# EAGLE design Daughter Card (EAGLE 6.5.1)
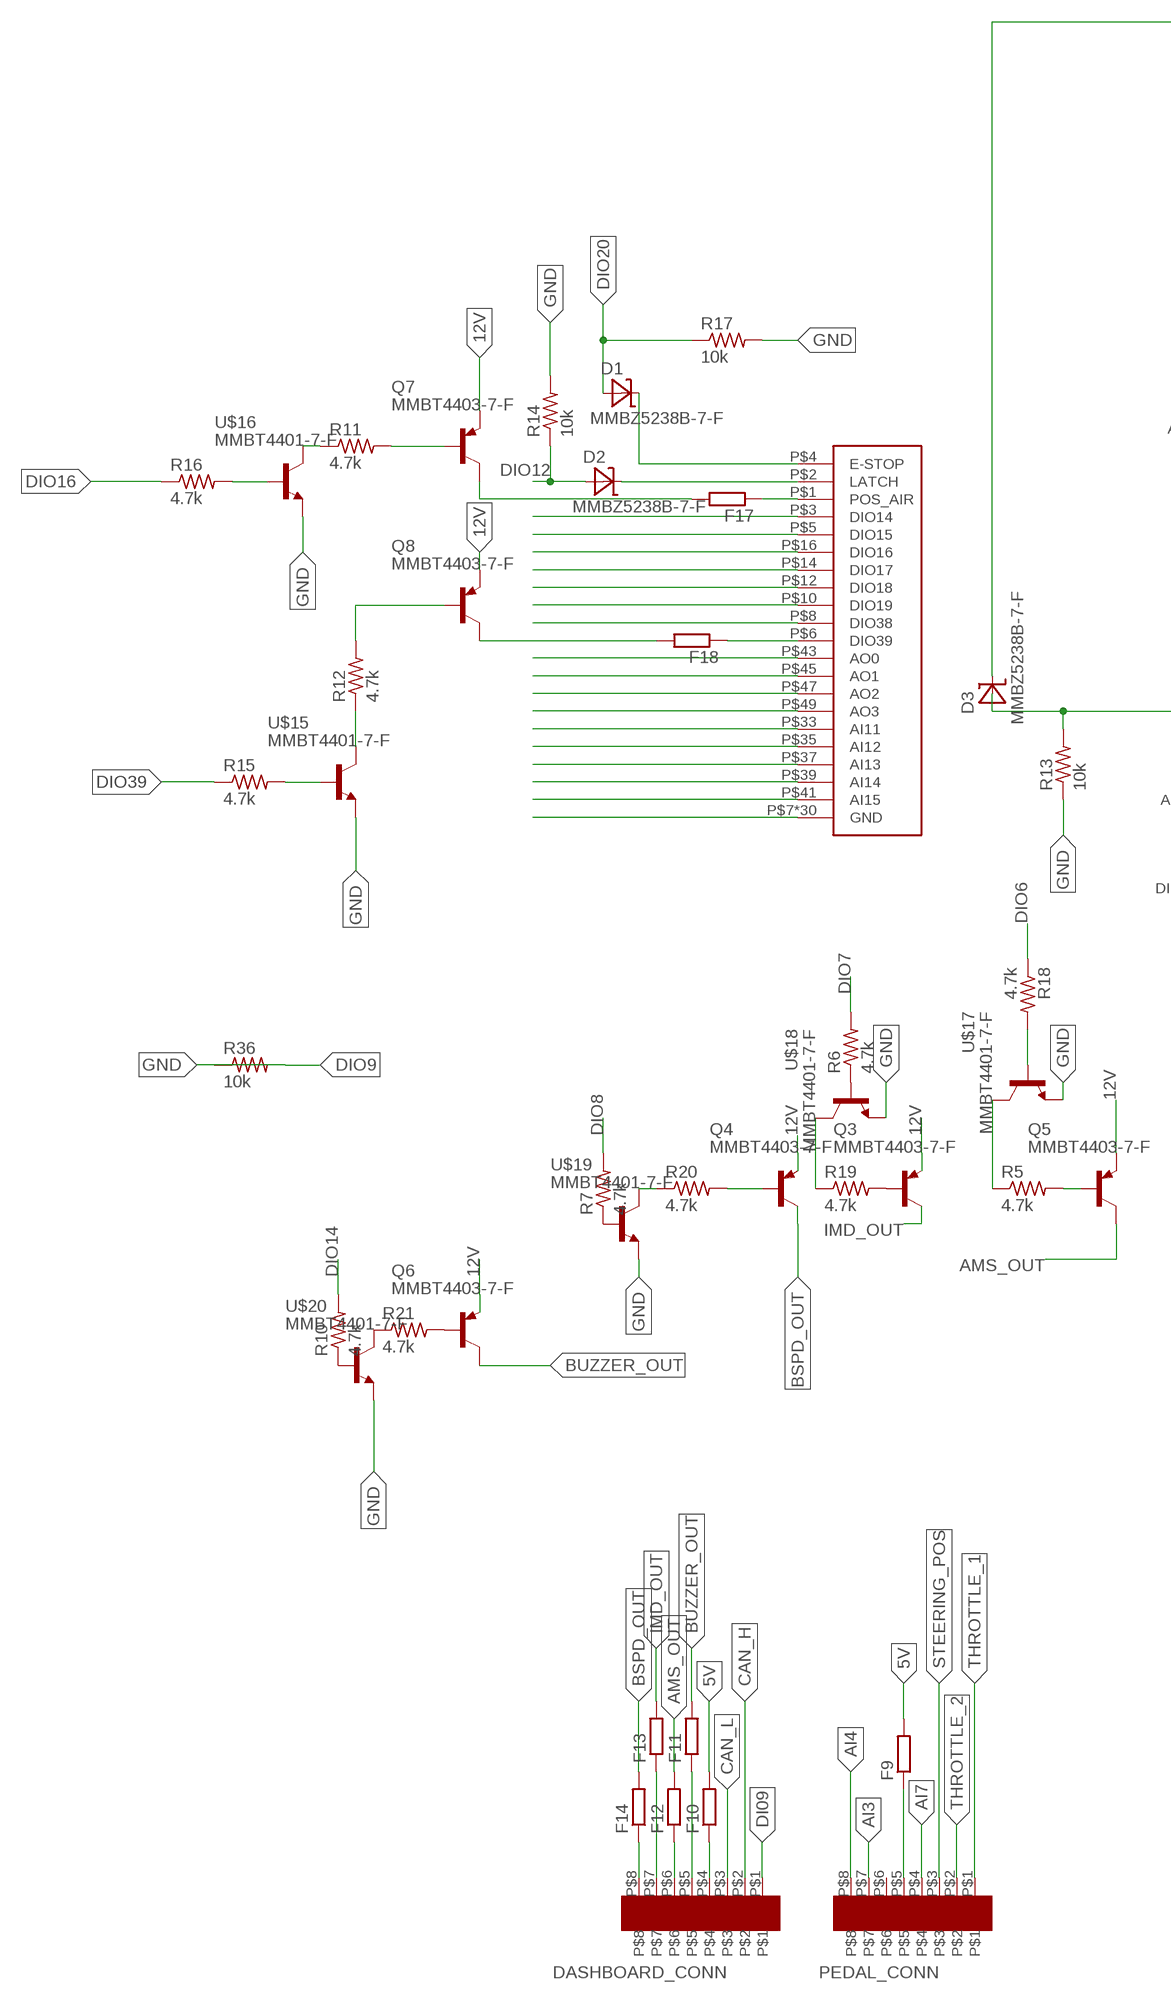
[diagram p0: schematic, sheet 1, part 1 of 2]
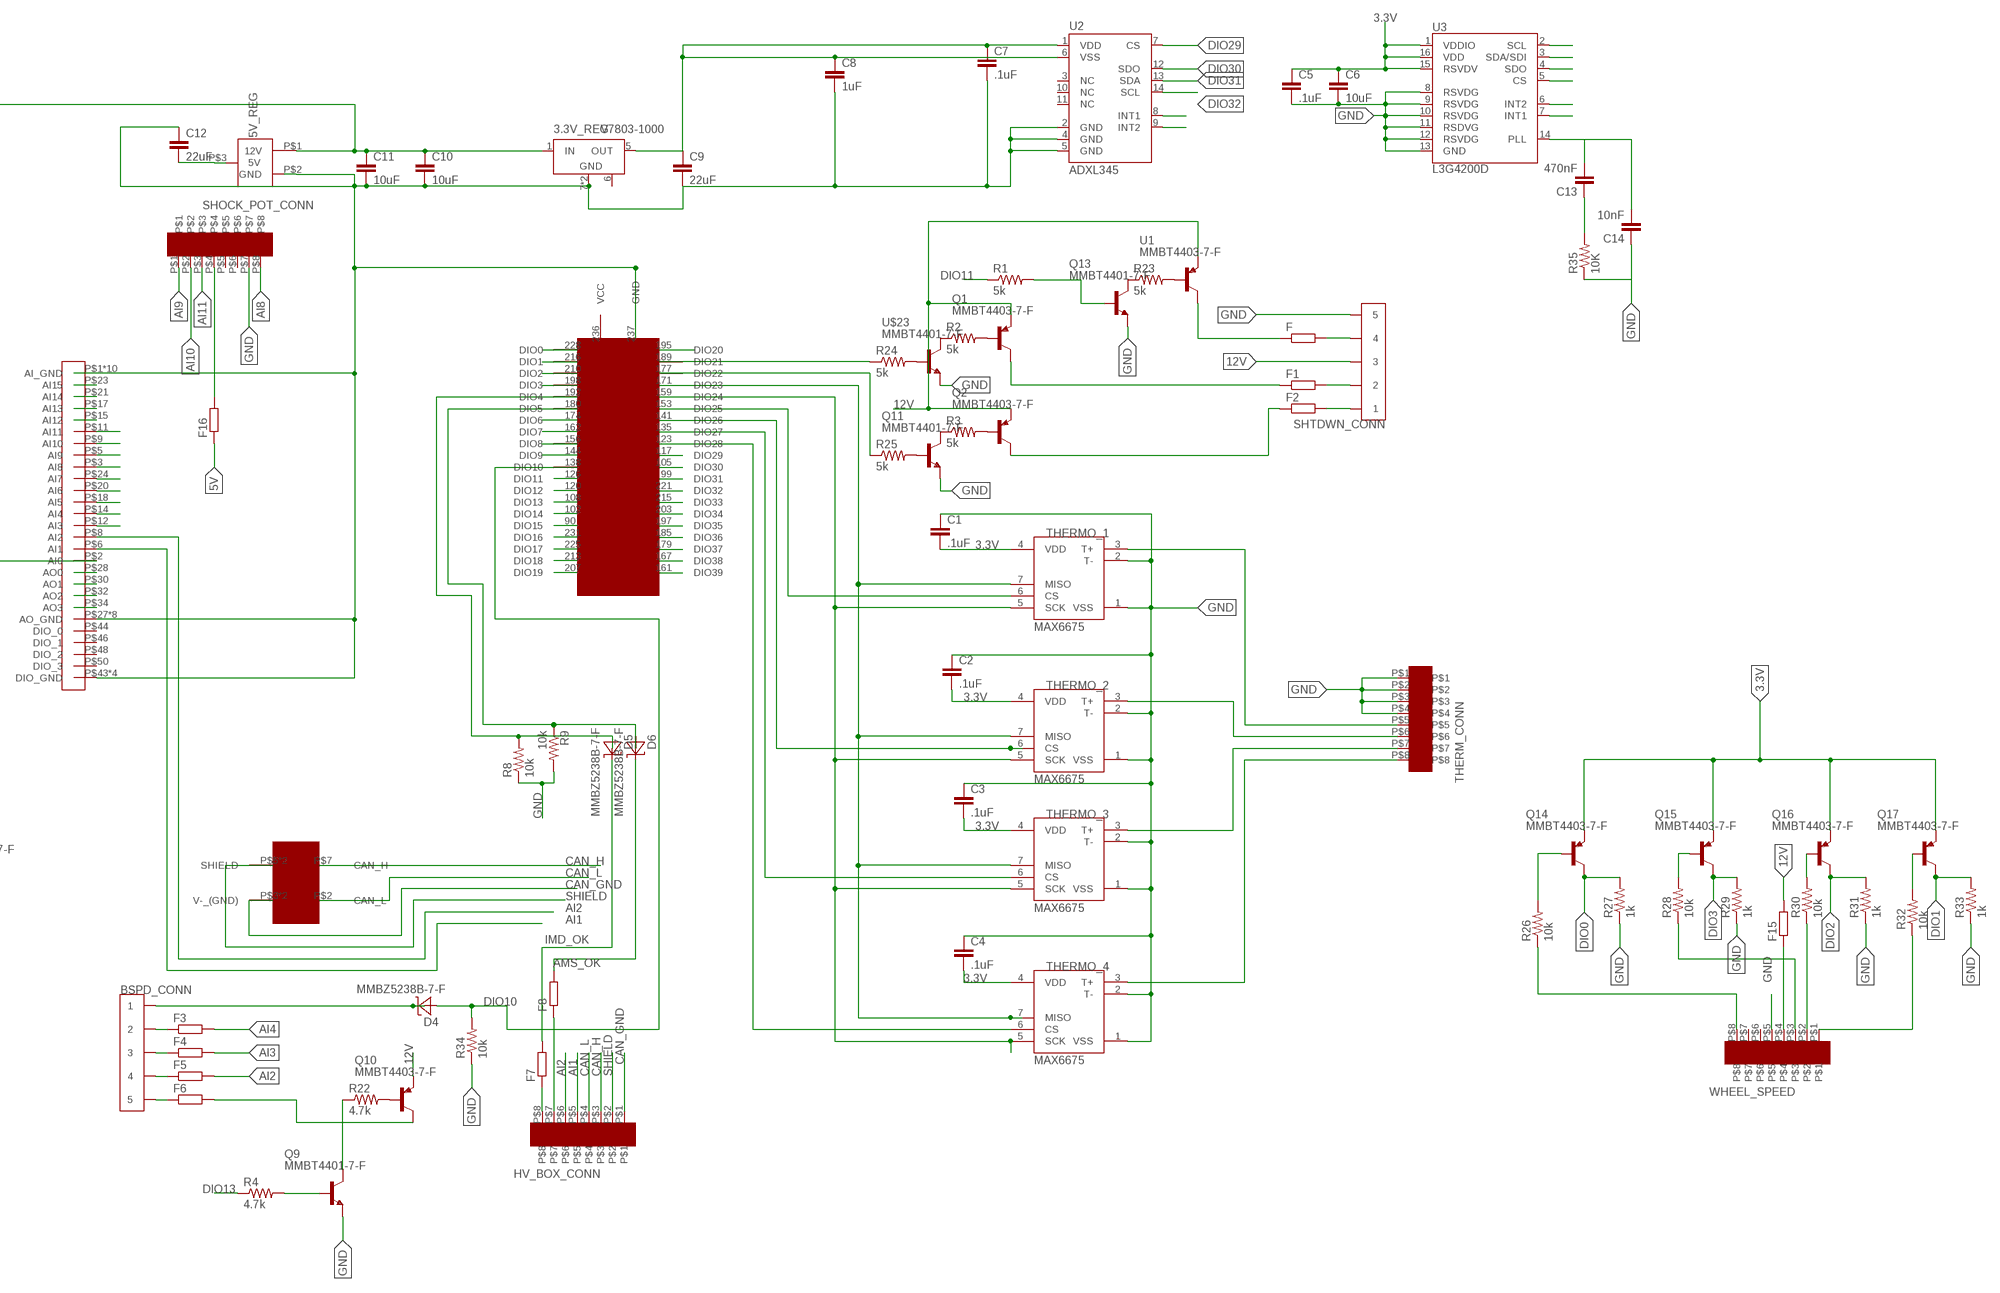
[diagram p1: schematic, sheet 1, part 2 of 2]

## Parts
3.3V_REG  V7803-1000  [V78XX-1000]
5V_REG  V78XX-1500  [V78XX-1500R]
BSPD_CONN  CONN_5  [CONNECTOR_5]
C1  .1uF  CAP0603-CAP  [0603-CAP]
C2  .1uF  CAP0603-CAP  [0603-CAP]
C3  .1uF  CAP0603-CAP  [0603-CAP]
C4  .1uF  CAP0603-CAP  [0603-CAP]
C5  .1uF  CAP0603-CAP  [0603-CAP]
C6  10uF  CAP0603-CAP  [0603-CAP]
C7  .1uF  CAP0603-CAP  [0603-CAP]
C8  1uF  CAP0603-CAP  [0603-CAP]
C9  22uF  CAP0603-CAP  [0603-CAP]
C10  10uF  CAP0603-CAP  [0603-CAP]
C11  10uF  CAP0603-CAP  [0603-CAP]
C12  22uF  CAP0603-CAP  [0603-CAP]
C13  470nF  CAP0603-CAP  [0603-CAP]
C14  10nF  CAP0603-CAP  [0603-CAP]
D1  MMBZ5238B-7-F  [SOT-23-3]
D2  MMBZ5238B-7-F  [SOT-23-3]
D3  MMBZ5238B-7-F  [SOT-23-3]
D4  MMBZ5238B-7-F  [SOT-23-3]
D5  MMBZ5238B-7-F  [SOT-23-3]
D6  MMBZ5238B-7-F  [SOT-23-3]
DASHBOARD_CONN  EN3_PCB_8  [EN3_PCB_8]
F  R-EU_R0402  [R0402]
F1  R-EU_R0402  [R0402]
F2  R-EU_R0402  [R0402]
F3  R-EU_R0402  [R0402]
F4  R-EU_R0402  [R0402]
F5  R-EU_R0402  [R0402]
F6  R-EU_R0402  [R0402]
F7  R-EU_R0402  [R0402]
F8  R-EU_R0402  [R0402]
F9  R-EU_R0402  [R0402]
F10  R-EU_R0402  [R0402]
F11  R-EU_R0402  [R0402]
F12  R-EU_R0402  [R0402]
F13  R-EU_R0402  [R0402]
F14  R-EU_R0402  [R0402]
F15  R-EU_R0402  [R0402]
F16  R-EU_R0402  [R0402]
F17  R-EU_R0402  [R0402]
F18  R-EU_R0402  [R0402]
HV_BOX_CONN  EN3_PCB_8  [EN3_PCB_8]
PEDAL_CONN  EN3_PCB_8  [EN3_PCB_8]
Q1  MMBT4403-7-F  [SOT-23-3]
Q2  MMBT4403-7-F  [SOT-23-3]
Q3  MMBT4403-7-F  [SOT-23-3]
Q4  MMBT4403-7-F  [SOT-23-3]
Q5  MMBT4403-7-F  [SOT-23-3]
Q6  MMBT4403-7-F  [SOT-23-3]
Q7  MMBT4403-7-F  [SOT-23-3]
Q8  MMBT4403-7-F  [SOT-23-3]
Q9  MMBT4401-7-F  [SOT-23-3]
Q10  MMBT4403-7-F  [SOT-23-3]
Q11  MMBT4401-7-F  [SOT-23-3]
Q13  MMBT4401-7-F  [SOT-23-3]
Q14  MMBT4403-7-F  [SOT-23-3]
Q15  MMBT4403-7-F  [SOT-23-3]
Q16  MMBT4403-7-F  [SOT-23-3]
Q17  MMBT4403-7-F  [SOT-23-3]
R1  5k  R-US_R0402  [R0402]
R2  5k  R-US_R0402  [R0402]
R3  5k  R-US_R0402  [R0402]
R4  4.7k  R-US_R0402  [R0402]
R5  4.7k  R-US_R0402  [R0402]
R6  4.7k  R-US_R0402  [R0402]
R7  4.7k  R-US_R0402  [R0402]
R8  10k  R-US_R0402  [R0402]
R9  10k  R-US_R0402  [R0402]
R10  4.7k  R-US_R0402  [R0402]
R11  4.7k  R-US_R0402  [R0402]
R12  4.7k  R-US_R0402  [R0402]
R13  10k  R-US_R0402  [R0402]
R14  10k  R-US_R0402  [R0402]
R15  4.7k  R-US_R0402  [R0402]
R16  4.7k  R-US_R0402  [R0402]
R17  10k  R-US_R0402  [R0402]
R18  4.7k  R-US_R0402  [R0402]
R19  4.7k  R-US_R0402  [R0402]
R20  4.7k  R-US_R0402  [R0402]
R21  4.7k  R-US_R0402  [R0402]
R22  4.7k  R-US_R0402  [R0402]
R23  5k  R-US_R0402  [R0402]
R24  5k  R-US_R0402  [R0402]
R25  5k  R-US_R0402  [R0402]
R26  10k  R-US_R0402  [R0402]
R27  1k  R-US_R0402  [R0402]
R28  10k  R-US_R0402  [R0402]
R29  1k  R-US_R0402  [R0402]
R30  10k  R-US_R0402  [R0402]
R31  1k  R-US_R0402  [R0402]
R32  10k  R-US_R0402  [R0402]
R33  1k  R-US_R0402  [R0402]
R34  10k  R-US_R0402  [R0402]
R35  10K  RESISTOR0603-RES  [0603-RES]
R36  10k  R-US_R0402  [R0402]
SBRIO_ANALOG  SBRIO_MIO  [SBRIO_J502_J503]
SBRIO_AUX  SBRIO_AUX  [SBRIO_J502_J503]
SHOCK_POT_CONN  EN3_PCB_8  [EN3_PCB_8]
SHTDWN_CONN  CONN_5  [CONNECTOR_5]
THERM_CONN  EN3_PCB_8  [EN3_PCB_8]
THERMO_1  MAX6675  [SO08]
THERMO_2  MAX6675  [SO08]
THERMO_3  MAX6675  [SO08]
THERMO_4  MAX6675  [SO08]
U1  MMBT4403-7-F  [SOT-23-3]
U2  ADXL345  [LGA14]
U3  L3G4200D  [LGA16-4X4]
U$2  SBRIO_W500  [SBRIO_W]
U$3  SBRIO_RMC  [SEAM-40-XX.X-XX-06-X-A]
U$15  MMBT4401-7-F  [SOT-23-3]
U$16  MMBT4401-7-F  [SOT-23-3]
U$17  MMBT4401-7-F  [SOT-23-3]
U$18  MMBT4401-7-F  [SOT-23-3]
U$19  MMBT4401-7-F  [SOT-23-3]
U$20  MMBT4401-7-F  [SOT-23-3]
U$23  MMBT4401-7-F  [SOT-23-3]
WHEEL_SPEED  EN3_PCB_8  [EN3_PCB_8]

## Nets
3.3V: 3.3V_REG.5(OUT) C1.2 C2.2 C3.2 C4.2 C5.1 C6.1 C7.1 C8.1 C9.1 Q14.P$3(E) Q15.P$3(E) Q16.P$3(E) Q17.P$3(E) THERMO_1.4(VDD) THERMO_2.4(VDD) THERMO_3.4(VDD) THERMO_4.4(VDD) U2.1(VDD) U2.6(VSS) U3.1(VDDIO) U3.15(RSVDV) U3.16(VDD)
5V: 5V_REG.P$3(5V) C12.2 F9.2 F10.2 F16.1
12V: 3.3V_REG.1(IN) 5V_REG.P$1(12V) C10.1 C11.1 D3.P$1(C) F15.2 Q1.P$3(E) Q2.P$3(E) Q3.P$3(E) Q4.P$3(E) Q5.P$3(E) Q6.P$3(E) Q7.P$3(E) Q8.P$3(E) Q10.P$3(E) SHTDWN_CONN.5 SHTDWN_CONN.6 U1.P$3(E)
AI1: HV_BOX_CONN.P$5 SBRIO_ANALOG.P$6(AI1)
AI2: F5.2 HV_BOX_CONN.P$6 SBRIO_ANALOG.P$8(AI2)
AI3: F4.2 PEDAL_CONN.P$7 SBRIO_ANALOG.P$12(AI3)
AI4: F3.2 PEDAL_CONN.P$8 SBRIO_ANALOG.P$14(AI4)
AI7: PEDAL_CONN.P$4 SBRIO_ANALOG.P$24(AI7)
AI8: SBRIO_ANALOG.P$3(AI8) SHOCK_POT_CONN.P$8
AI9: SBRIO_ANALOG.P$5(AI9) SHOCK_POT_CONN.P$1
AI10: SBRIO_ANALOG.P$9(AI10) SHOCK_POT_CONN.P$2
AI11: SBRIO_ANALOG.P$11(AI11) SBRIO_AUX.P$33(AI11) SHOCK_POT_CONN.P$3
AI12: SBRIO_ANALOG.P$15(AI12) SBRIO_AUX.P$35(AI12)
AI13: SBRIO_ANALOG.P$17(AI13) SBRIO_AUX.P$37(AI13)
AI15: SBRIO_ANALOG.P$23(AI15) SBRIO_AUX.P$41(AI15)
AMS_OK: D6.P$1(C) F8.2
AMS_OUT: F12.2 Q5.P$1(C)
AO0: SBRIO_ANALOG.P$28(AO0) SBRIO_AUX.P$43(AO0)
AO1: SBRIO_ANALOG.P$30(AO1) SBRIO_AUX.P$45(AO1)
AO2: SBRIO_ANALOG.P$32(AO2) SBRIO_AUX.P$47(AO2)
AO3: SBRIO_ANALOG.P$34(AO3) SBRIO_AUX.P$49(AO3)
BSPD_OUT: F14.2 Q4.P$1(C)
BUZZER_OUT: F11.2 Q6.P$1(C)
CAN_GND: HV_BOX_CONN.P$1 U$2.P$3(V-_(GND)) U$2.P$6(V-_(GND))
CAN_H: DASHBOARD_CONN.P$2 HV_BOX_CONN.P$3 U$2.P$7(CAN_H)
CAN_L: DASHBOARD_CONN.P$3 HV_BOX_CONN.P$4 U$2.P$2(CAN_L)
DI09: DASHBOARD_CONN.P$1
DIO0: Q14.P$1(C) R27.2 U$3.228(DIO0)
DIO1: Q17.P$1(C) R33.2 U$3.216(DIO1)
DIO2: Q16.P$1(C) R31.2 U$3.210(DIO2)
DIO3: Q15.P$1(C) R29.2 U$3.198(DIO3)
DIO6: R18.1 U$3.174(DIO6)
DIO7: R6.2 U$3.162(DIO7)
DIO8: R7.2 U$3.156(DIO8)
DIO9: R36.2 U$3.144(DIO9)
DIO10: D4.P$2(A) R34.2 U$3.138(DIO10)
DIO11: R1.1 U$3.126(DIO11)
DIO12: D2.P$2(A) R14.1 U$3.120(DIO12)
DIO13: R4.1 U$3.108(DIO13)
DIO14: R10.2 SBRIO_AUX.P$3(DIO14) U$3.102(DIO14)
DIO15: SBRIO_AUX.P$5(DIO15) U$3.90(DIO15)
DIO16: R16.1 SBRIO_AUX.P$16(DIO16) U$3.231(DIO16)
DIO17: SBRIO_AUX.P$14(DIO17) U$3.225(DIO17)
DIO18: SBRIO_AUX.P$12(DIO18) U$3.213(DIO18)
DIO19: SBRIO_AUX.P$10(DIO19) U$3.207(DIO19)
DIO20: D1.P$2(A) R17.1 U$3.195(DIO20)
DIO29: U2.7(CS) U$3.117(DIO29)
DIO30: U2.12(SDO) U3.4(SDO) U$3.105(DIO30)
DIO31: U2.13(SDA) U3.3(SDA/SDI) U$3.99(DIO31)
DIO32: U2.14(SCL) U3.2(SCL) U$3.221(DIO32)
DIO33: U3.5(CS) U$3.215(DIO33)
DIO34: U3.7(INT1) U$3.203(DIO34)
DIO35: U3.6(INT2) U$3.197(DIO35)
DIO36: U2.8(INT1) U$3.185(DIO36)
DIO37: U2.9(INT2) U$3.179(DIO37)
DIO38: SBRIO_AUX.P$8(DIO38) U$3.167(DIO38)
DIO39: R15.1 U$3.161(DIO39)
GND: 3.3V_REG.7(GND) 3.3V_REG.9(GND) 5V_REG.P$2(GND) C1.1 C2.1 C3.1 C4.1 C5.2 C6.2 C7.2 C8.2 C9.2 C10.2 C11.2 C12.1 C14.1 Q9.P$3(E) Q11.P$3(E) Q13.P$3(E) R8.1 R9.2 R13.1 R14.2 R17.2 R27.1 R29.1 R31.1 R33.1 R34.1 R35.1 R36.1 SBRIO_ANALOG.P$1(AI_GND) SBRIO_ANALOG.P$4(AI_GND) SBRIO_ANALOG.P$7(AI_GND) SBRIO_ANALOG.P$10(AI_GND) SBRIO_ANALOG.P$13(AI_GND) SBRIO_ANALOG.P$16(AI_GND) SBRIO_ANALOG.P$19(AI_GND) SBRIO_ANALOG.P$22(AI_GND) SBRIO_ANALOG.P$25(AI_GND) SBRIO_ANALOG.P$26(AI_GND) SBRIO_ANALOG.P$27(AO_GND) SBRIO_ANALOG.P$29(AO_GND) SBRIO_ANALOG.P$31(AO_GND) SBRIO_ANALOG.P$33(AO_GND) SBRIO_ANALOG.P$35(AO_GND) SBRIO_ANALOG.P$37(AO_GND) SBRIO_ANALOG.P$39(AO_GND) SBRIO_ANALOG.P$41(AO_GND) SBRIO_ANALOG.P$43(DIO_GND) SBRIO_ANALOG.P$45(DIO_GND) SBRIO_ANALOG.P$47(DIO_GND) SBRIO_ANALOG.P$49(DIO_GND) SBRIO_AUX.P$7(GND) SBRIO_AUX.P$9(GND) SBRIO_AUX.P$11(GND) SBRIO_AUX.P$13(GND) SBRIO_AUX.P$15(GND) SBRIO_AUX.P$17(GND) SBRIO_AUX.P$18(GND) SBRIO_AUX.P$19(GND) SBRIO_AUX.P$20(GND) SBRIO_AUX.P$21(GND) SBRIO_AUX.P$22(GND) SBRIO_AUX.P$23(GND) SBRIO_AUX.P$24(GND) SBRIO_AUX.P$25(GND) SBRIO_AUX.P$26(GND) SBRIO_AUX.P$27(GND) SBRIO_AUX.P$28(GND) SBRIO_AUX.P$29(GND) SBRIO_AUX.P$30(GND) SBRIO_AUX.P$31(GND) SBRIO_AUX.P$32(GND) SBRIO_AUX.P$34(GND) SBRIO_AUX.P$36(GND) SBRIO_AUX.P$38(GND) SBRIO_AUX.P$40(GND) SBRIO_AUX.P$42(GND) SBRIO_AUX.P$44(GND) SBRIO_AUX.P$46(GND) SBRIO_AUX.P$48(GND) SBRIO_AUX.P$50(GND) SHOCK_POT_CONN.P$7 SHTDWN_CONN.9 SHTDWN_CONN.10 THERM_CONN.P$1 THERM_CONN.P$2 THERM_CONN.P$3 THERM_CONN.P$4 THERMO_1.1(VSS) THERMO_1.2(T-) THERMO_2.1(VSS) THERMO_2.2(T-) THERMO_3.1(VSS) THERMO_3.2(T-) THERMO_4.1(VSS) THERMO_4.2(T-) U2.2(GND) U2.4(GND) U2.5(GND) U3.8(RSVDG) U3.9(RSVDG) U3.10(RSVDG) U3.11(RSDVG) U3.12(RSVDG) U3.13(GND) U$3.237(GND) U$15.P$3(E) U$16.P$3(E) U$17.P$3(E) U$18.P$3(E) U$19.P$3(E) U$20.P$3(E) U$23.P$3(E) WHEEL_SPEED.P$5
IMD_OK: D5.P$1(C) F7.2
IMD_OUT: F13.2 Q3.P$1(C)
N$1: D2.P$1(C) SBRIO_AUX.P$2(LATCH)
N$2: D1.P$1(C) SBRIO_AUX.P$4(E-STOP)
N$3: R32.1 WHEEL_SPEED.P$1
N$4: D3.P$2(A) R13.2 SBRIO_ANALOG.P$2(AI0)
N$5: Q6.P$2(B) R21.2
N$6: Q16.P$2(B) R30.2
N$7: F1.1 Q1.P$1(C)
N$8: F2.1 Q2.P$1(C)
N$9: R28.1 WHEEL_SPEED.P$3
N$10: R26.1 WHEEL_SPEED.P$8
N$11: R24.1 U$3.189(DIO21)
N$12: R25.1 U$3.177(DIO22)
N$13: F8.1 HV_BOX_CONN.P$7
N$14: F7.1 HV_BOX_CONN.P$8
N$15: D5.P$2(A) R8.2 U$3.192(DIO4)
N$16: D6.P$2(A) R9.1 U$3.180(DIO5)
N$17: THERMO_1.7(MISO) THERMO_2.7(MISO) THERMO_3.7(MISO) THERMO_4.7(MISO) U$3.171(DIO23)
N$18: THERMO_1.5(SCK) THERMO_2.5(SCK) THERMO_3.5(SCK) THERMO_4.5(SCK) U$3.159(DIO24)
N$20: F16.2 SHOCK_POT_CONN.P$4
N$21: F15.1 WHEEL_SPEED.P$4
N$22: F9.1 PEDAL_CONN.P$5
N$23: DASHBOARD_CONN.P$4 F10.1
N$24: DASHBOARD_CONN.P$5 F11.1
N$25: THERMO_1.6(CS) U$3.153(DIO25)
N$26: THERMO_2.6(CS) U$3.141(DIO26)
N$27: THERMO_3.6(CS) U$3.135(DIO27)
N$28: THERMO_4.6(CS) U$3.123(DIO28)
N$29: THERM_CONN.P$5 THERMO_1.3(T+)
N$30: THERM_CONN.P$6 THERMO_2.3(T+)
N$31: THERM_CONN.P$7 THERMO_3.3(T+)
N$32: THERM_CONN.P$8 THERMO_4.3(T+)
N$33: DASHBOARD_CONN.P$6 F12.1
N$34: DASHBOARD_CONN.P$7 F13.1
N$35: DASHBOARD_CONN.P$8 F14.1
N$36: F.2 SHTDWN_CONN.7 SHTDWN_CONN.8
N$37: C13.2 C14.2 U3.14(PLL)
N$38: C13.1 R35.2
N$39: F1.2 SHTDWN_CONN.3 SHTDWN_CONN.4
N$40: F2.2 SHTDWN_CONN.1 SHTDWN_CONN.2
N$41: BSPD_CONN.9 BSPD_CONN.10 F6.1
N$42: BSPD_CONN.1 BSPD_CONN.2 D4.P$1(C)
N$43: BSPD_CONN.7 BSPD_CONN.8 F5.1
N$44: F.1 U1.P$1(C)
N$45: F6.2 Q10.P$1(C)
N$46: R23.2 U1.P$2(B)
N$47: Q1.P$2(B) R2.2
N$48: Q2.P$2(B) R3.2
N$49: Q10.P$2(B) R22.2
N$50: Q5.P$2(B) R5.2
N$51: Q3.P$2(B) R19.2
N$52: BSPD_CONN.5 BSPD_CONN.6 F4.1
N$53: BSPD_CONN.3 BSPD_CONN.4 F3.1
N$54: Q7.P$2(B) R11.2
N$55: F17.1 SBRIO_AUX.P$1(POS_AIR)
N$56: F17.2 Q7.P$1(C)
N$57: F18.2 Q8.P$1(C)
N$58: Q8.P$2(B) R12.2
N$59: F18.1 SBRIO_AUX.P$6(DIO39)
N$60: R15.2 U$15.P$2(B)
N$61: R12.1 U$15.P$1(C)
N$62: R16.2 U$16.P$2(B)
N$63: R11.1 U$16.P$1(C)
N$64: R5.1 U$17.P$1(C)
N$65: R18.2 U$17.P$2(B)
N$66: R19.1 U$18.P$1(C)
N$67: R6.1 U$18.P$2(B)
N$68: Q4.P$2(B) R20.2
N$69: R20.1 U$19.P$1(C)
N$70: R7.1 U$19.P$2(B)
N$71: R21.1 U$20.P$1(C)
N$72: R10.1 U$20.P$2(B)
N$73: Q9.P$1(C) R22.1
N$74: Q9.P$2(B) R4.2
N$75: Q13.P$1(C) R23.1
N$76: Q13.P$2(B) R1.2
N$77: R2.1 U$23.P$1(C)
N$78: Q11.P$1(C) R3.1
N$79: R24.2 U$23.P$2(B)
N$80: Q11.P$2(B) R25.2
N$81: Q14.P$2(B) R26.2
N$82: Q15.P$2(B) R28.2
N$83: R30.1 WHEEL_SPEED.P$2
N$84: Q17.P$2(B) R32.2
SHIELD: HV_BOX_CONN.P$2 U$2.P$5(SHIELD) U$2.P$10(SHIELD)
STEERING_POS: PEDAL_CONN.P$3 SBRIO_ANALOG.P$21(AI14) SBRIO_AUX.P$39(AI14)
THROTTLE_1: PEDAL_CONN.P$1 SBRIO_ANALOG.P$18(AI5)
THROTTLE_2: PEDAL_CONN.P$2 SBRIO_ANALOG.P$20(AI6)
Unconnected: 3.3V_REG.6 PEDAL_CONN.P$6 SBRIO_ANALOG.P$44(DIO_0) SBRIO_ANALOG.P$46(DIO_1) SBRIO_ANALOG.P$48(DIO_2) SBRIO_ANALOG.P$50(DIO_3) SHOCK_POT_CONN.P$5 SHOCK_POT_CONN.P$6 U2.3(NC) U2.10(NC) U2.11(NC) WHEEL_SPEED.P$6 WHEEL_SPEED.P$7

## Power pins joined to a net without a drawn wire
VCC: U$3.236(VCC)

## Library data of the parts
3.3V_REG = formula electric:V7803-1000
5V_REG = formula electric:V78XX-1500
BSPD_CONN SHTDWN_CONN = formula electric:CONN_5
C1-C14 = SparkFun-Passives:CAP: Capacitor Standard 0603 ceramic capacitor, and 0.1" leaded capacitor.
D1-D6 = formula electric:MMBZ5238B-7-F: Digikey: MMBZ5238B-FDICT-ND
DASHBOARD_CONN HV_BOX_CONN PEDAL_CONN SHOCK_POT_CONN THERM_CONN WHEEL_SPEED = formula electric:EN3_PCB_8
F F1-F18 = resistor:R-EU_: RESISTOR, European symbol
Q1-Q8 Q10 Q14-Q17 U1 = formula electric:MMBT4403-7-F
Q9 Q11 Q13 U$15-U$20 U$23 = formula electric:MMBT4401-7-F
R1-R34 R36 = resistor:R-US_: RESISTOR, American symbol
R35 = SparkFun-Passives:RESISTOR: Resistor Basic schematic elements and footprints for 0603, 1206, and PTH resistors.
SBRIO_ANALOG = formula electric:SBRIO_MIO
SBRIO_AUX = formula electric:SBRIO_AUX: An output for a lot of the extra pins on the sbRIO.
THERMO_1-THERMO_4 = max6675:MAX6675
U2 = SparkFun-Sensors:ADXL345: 3-axis SPI/I2C 2/4/8/16g accelerometer
U3 = SparkFun-Sensors:L3G4200D: L3G4200D Three-axis, digital output gyroscope The L3G4200D is a low-power three-axis angular rate sensor, has a full scale of ±250/±500/±2000 dps and is capable of measuring rates with a user-selectable bandwidth. It includes a sensing element and an IC interface capable of providing the measured angular rate to the external world through a digital interface (I2C/SPI). Package: 4x4x1.1 LGA-16 (LGA16-4x4.PAC)
U$2 = formula electric:SBRIO_W500
U$3 = SEAM-40-XX.X-XX-06-X-A:SBRIO_RMC

## Net classes
0 default: clearance 0.205 mm

## Board
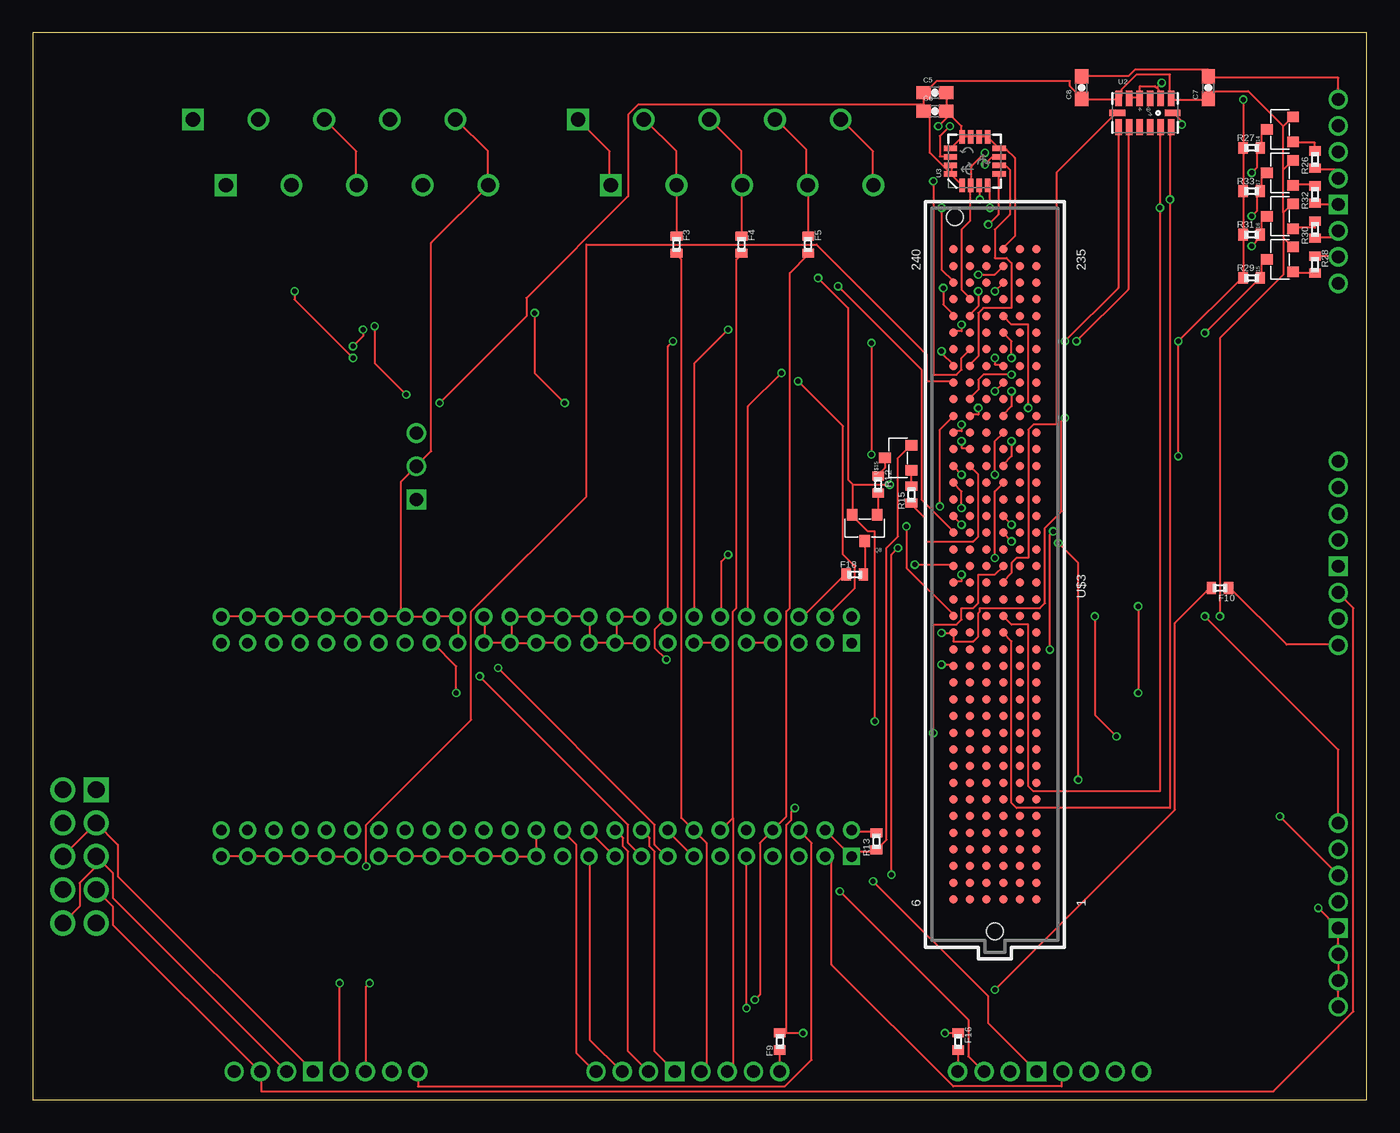
[diagram p2: board, top side]
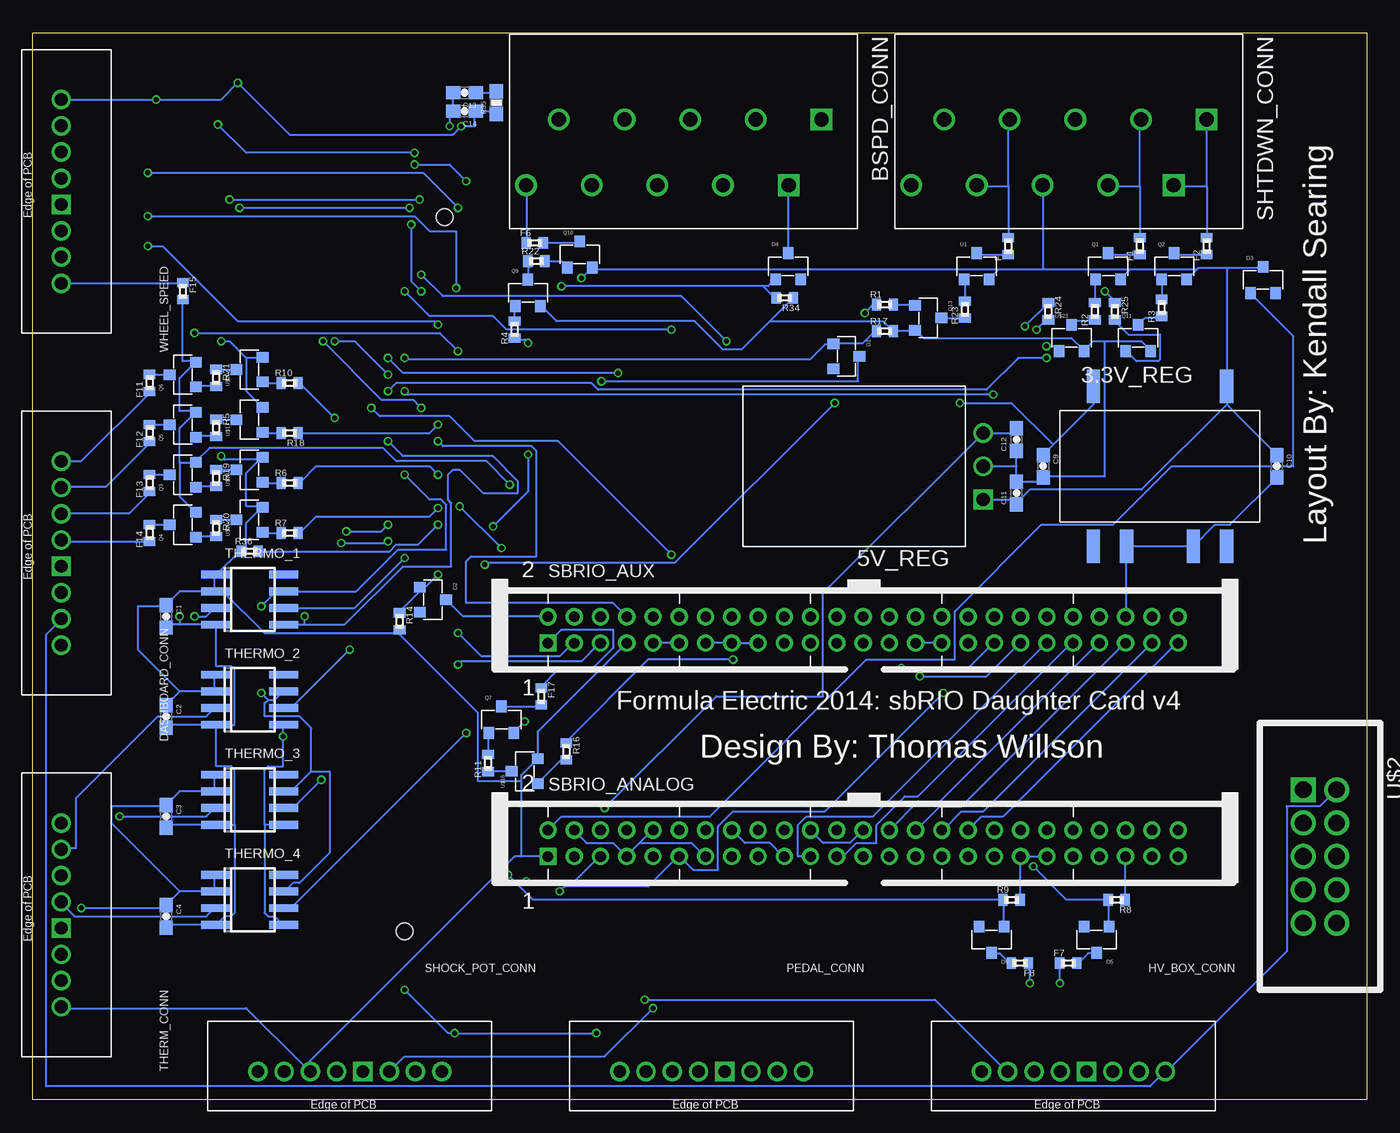
[diagram p3: board, bottom side, seen from below]

Size 101.6 x 81.28 mm. Coordinates in mm from the lower left corner, seen from the top.
Outline: 0,0 101.6,0 101.6,81.28 0,81.28 0,0
Copper layers (1*16): Top 0.035mm / dielectric 1.5mm / Bottom 0.035mm
Design rules "PCBFabExpress DRC *": minimum track width 6mil, minimum drill 15mil, track to track 6mil, track to pad 8mil, pad to pad 8mil, via to via 8mil, smd to smd 8mil, copper to edge 10mil, drill to drill 8mil, minimum pad ring 10mil, minimum via ring 5mil, stop-mask expansion 2mil, vias tented up to drill 100mil, thermal gap 10mil

### Footprints (pad centres in the part's own frame; a part is rotated, then mirrored left to right if it is on the bottom)
V78XX-1000 = smd 1 x 2.54: 1 -5.08,-6.096; 5 5.08,-6.096; 6 5.08,6.096; 7 2.54,6.096; 9 -2.54,6.096; 10 -5.08,6.096
V78XX-1500R = drill 1 square: P$1 0,2.54 | drill 1: P$2 0,0; P$3 0,-2.54
CONNECTOR_5 = drill 1.1 square: 1 0,0; 2 2.5,5 | drill 1.1: 3 5,0; 4 7.5,5; 5 10,0; 6 12.5,5; 7 15,0; 8 17.5,5; 9 20,0; 10 22.5,5
0603-CAP = smd 1.1 x 1: 1 -0.85,0; 2 0.85,0
SOT-23-3 = smd 0.8 x 0.9: P$1 0,1; P$2 -0.95,-1; P$3 0.95,-1
EN3_PCB_8 = drill 0.965 pad 1.397 square: P$1 0,0 | drill 0.965 pad 1.397: P$2 2,0; P$3 4,0; P$4 6,0; P$5 -8,0; P$6 -6,0; P$7 -4,0; P$8 -2,0
R0402 = smd 0.7 x 0.9: 1 -0.65,0; 2 0.65,0
0603-RES = smd 1.1 x 1: 1 -0.85,0; 2 0.85,0
SBRIO_J502_J503 = drill 0.8 square: P$1 0,0 | drill 0.8: P$2 0,2; P$3 2,0; P$4 2,2; P$5 4,0; P$6 4,2; P$7 6,0; P$8 6,2; P$9 8,0; P$10 8,2; P$11 10,0; P$12 10,2; P$13 12,0; P$14 12,2; P$15 14,0; P$16 14,2; P$17 16,0; P$18 16,2; P$19 18,0; P$20 18,2; P$21 20,0; P$22 20,2; P$23 22,0; P$24 22,2; P$25 24,0; P$26 24,2; P$27 26,0; P$28 26,2; P$29 28,0; P$30 28,2; P$31 30,0; P$32 30,2; P$33 32,0; P$34 32,2; P$35 34,0; P$36 34,2; P$37 36,0; P$38 36,2; P$39 38,0; P$40 38,2; P$41 40,0; P$42 40,2; P$43 42,0; P$44 42,2; P$45 44,0; P$46 44,2; P$47 46,0; P$48 46,2; P$49 48,0; P$50 48,2
SO08 = smd 0.6 x 2.2: 1 -1.905,-2.6; 2 -0.635,-2.6; 3 0.635,-2.6; 4 1.905,-2.6; 5 1.905,2.6; 6 0.635,2.6; 7 -0.635,2.6; 8 -1.905,2.6
LGA14 = smd 0.5 x 1.2: 1 2,1.1; 2 1.2,1.1; 3 0.4,1.1; 4 -0.4,1.1; 5 -1.2,1.1; 6 -2,1.1; 8 -2,-1.1; 9 -1.2,-1.1; 10 -0.4,-1.1; 11 0.4,-1.1; 12 1.2,-1.1; 13 2,-1.1 | smd 1.2 x 0.5: 7 -2.1,0; 14 2.1,0
LGA16-4X4 = smd 1 x 0.4: 1 -1.85,0.975; 2 -1.85,0.325; 3 -1.85,-0.325; 4 -1.85,-0.975; 9 1.85,-0.975; 10 1.85,-0.325; 11 1.85,0.325; 12 1.85,0.975 | smd 0.4 x 1: 5 -0.975,-1.85; 6 -0.325,-1.85; 7 0.325,-1.85; 8 0.975,-1.85; 13 0.975,1.85; 14 0.325,1.85; 15 -0.325,1.85; 16 -0.975,1.85
SBRIO_W = drill 1.27 pad 1.778 square: P$1 -5.08,-1.27 | drill 1.27 pad 1.778: P$2 -5.08,1.27; P$3 -2.54,-1.27; P$4 -2.54,1.27; P$5 0,-1.27; P$6 0,1.27; P$7 2.54,-1.27; P$8 2.54,1.27; P$9 5.08,-1.27; P$10 5.08,1.27
SEAM-40-XX.X-XX-06-X-A = smd 0.635 x 0.635: 1 24.765,3.175; 2 24.765,1.905; 3 24.765,0.635; 4 24.765,-0.635; 5 24.765,-1.905; 6 24.765,-3.175; 7 23.495,3.175; 8 23.495,1.905; 9 23.495,0.635; 10 23.495,-0.635; 11 23.495,-1.905; 12 23.495,-3.175; 13 22.225,3.175; 14 22.225,1.905; 15 22.225,0.635; 16 22.225,-0.635; 17 22.225,-1.905; 18 22.225,-3.175; 19 20.955,3.175; 20 20.955,1.905; 21 20.955,0.635; 22 20.955,-0.635; 23 20.955,-1.905; 24 20.955,-3.175; 25 19.685,3.175; 26 19.685,1.905; 27 19.685,0.635; 28 19.685,-0.635; 29 19.685,-1.905; 30 19.685,-3.175; 31 18.415,3.175; 32 18.415,1.905; 33 18.415,0.635; 34 18.415,-0.635; 35 18.415,-1.905; 36 18.415,-3.175; 37 17.145,3.175; 38 17.145,1.905; 39 17.145,0.635; 40 17.145,-0.635; 41 17.145,-1.905; 42 17.145,-3.175; 43 15.875,3.175; 44 15.875,1.905; 45 15.875,0.635; 46 15.875,-0.635; 47 15.875,-1.905; 48 15.875,-3.175; 49 14.605,3.175; 50 14.605,1.905; 51 14.605,0.635; 52 14.605,-0.635; 53 14.605,-1.905; 54 14.605,-3.175; 55 13.335,3.175; 56 13.335,1.905; 57 13.335,0.635; 58 13.335,-0.635; 59 13.335,-1.905; 60 13.335,-3.175; 61 12.065,3.175; 62 12.065,1.905; 63 12.065,0.635; 64 12.065,-0.635; 65 12.065,-1.905; 66 12.065,-3.175; 67 10.795,3.175; 68 10.795,1.905; 69 10.795,0.635; 70 10.795,-0.635; 71 10.795,-1.905; 72 10.795,-3.175; 73 9.525,3.175; 74 9.525,1.905; 75 9.525,0.635; 76 9.525,-0.635; 77 9.525,-1.905; 78 9.525,-3.175; 79 8.255,3.175; 80 8.255,1.905; 81 8.255,0.635; 82 8.255,-0.635; 83 8.255,-1.905; 84 8.255,-3.175; 85 6.985,3.175; 86 6.985,1.905; 87 6.985,0.635; 88 6.985,-0.635; 89 6.985,-1.905; 90 6.985,-3.175; 91 5.715,3.175; 92 5.715,1.905; 93 5.715,0.635; 94 5.715,-0.635; 95 5.715,-1.905; 96 5.715,-3.175; 97 4.445,3.175; 98 4.445,1.905; 99 4.445,0.635; 100 4.445,-0.635; 101 4.445,-1.905; 102 4.445,-3.175; 103 3.175,3.175; 104 3.175,1.905; 105 3.175,0.635; 106 3.175,-0.635; 107 3.175,-1.905; 108 3.175,-3.175; 109 1.905,3.175; 110 1.905,1.905; 111 1.905,0.635; 112 1.905,-0.635; 113 1.905,-1.905; 114 1.905,-3.175; 115 0.635,3.175; 116 0.635,1.905; 117 0.635,0.635; 118 0.635,-0.635; 119 0.635,-1.905; 120 0.635,-3.175; 121 -0.635,3.175; 122 -0.635,1.905; 123 -0.635,0.635; 124 -0.635,-0.635; 125 -0.635,-1.905; 126 -0.635,-3.175; 127 -1.905,3.175; 128 -1.905,1.905; 129 -1.905,0.635; 130 -1.905,-0.635; 131 -1.905,-1.905; 132 -1.905,-3.175; 133 -3.175,3.175; 134 -3.175,1.905; 135 -3.175,0.635; 136 -3.175,-0.635; 137 -3.175,-1.905; 138 -3.175,-3.175; 139 -4.445,3.175; 140 -4.445,1.905; 141 -4.445,0.635; 142 -4.445,-0.635; 143 -4.445,-1.905; 144 -4.445,-3.175; 145 -5.715,3.175; 146 -5.715,1.905; 147 -5.715,0.635; 148 -5.715,-0.635; 149 -5.715,-1.905; 150 -5.715,-3.175; 151 -6.985,3.175; 152 -6.985,1.905; 153 -6.985,0.635; 154 -6.985,-0.635; 155 -6.985,-1.905; 156 -6.985,-3.175; 157 -8.255,3.175; 158 -8.255,1.905; 159 -8.255,0.635; 160 -8.255,-0.635; 161 -8.255,-1.905; 162 -8.255,-3.175; 163 -9.525,3.175; 164 -9.525,1.905; 165 -9.525,0.635; 166 -9.525,-0.635; 167 -9.525,-1.905; 168 -9.525,-3.175; 169 -10.795,3.175; 170 -10.795,1.905; 171 -10.795,0.635; 172 -10.795,-0.635; 173 -10.795,-1.905; 174 -10.795,-3.175; 175 -12.065,3.175; 176 -12.065,1.905; 177 -12.065,0.635; 178 -12.065,-0.635; 179 -12.065,-1.905; 180 -12.065,-3.175; 181 -13.335,3.175; 182 -13.335,1.905; 183 -13.335,0.635; 184 -13.335,-0.635; 185 -13.335,-1.905; 186 -13.335,-3.175; 187 -14.605,3.175; 188 -14.605,1.905; 189 -14.605,0.635; 190 -14.605,-0.635; 191 -14.605,-1.905; 192 -14.605,-3.175; 193 -15.875,3.175; 194 -15.875,1.905; 195 -15.875,0.635; 196 -15.875,-0.635; 197 -15.875,-1.905; 198 -15.875,-3.175; 199 -17.145,3.175; 200 -17.145,1.905; 201 -17.145,0.635; 202 -17.145,-0.635; 203 -17.145,-1.905; 204 -17.145,-3.175; 205 -18.415,3.175; 206 -18.415,1.905; 207 -18.415,0.635; 208 -18.415,-0.635; 209 -18.415,-1.905; 210 -18.415,-3.175; 211 -19.685,3.175; 212 -19.685,1.905; 213 -19.685,0.635; 214 -19.685,-0.635; 215 -19.685,-1.905; 216 -19.685,-3.175; 217 -20.955,3.175; 218 -20.955,1.905; 219 -20.955,0.635; 220 -20.955,-0.635; 221 -20.955,-1.905; 222 -20.955,-3.175; 223 -22.225,3.175; 224 -22.225,1.905; 225 -22.225,0.635; 226 -22.225,-0.635; 227 -22.225,-1.905; 228 -22.225,-3.175; 229 -23.495,3.175; 230 -23.495,1.905; 231 -23.495,0.635; 232 -23.495,-0.635; 233 -23.495,-1.905; 234 -23.495,-3.175; 235 -24.765,3.175; 236 -24.765,1.905; 237 -24.765,0.635; 238 -24.765,-0.635; 239 -24.765,-1.905; 240 -24.765,-3.175 | hole 1.27: 27.191,0; -27.191,-3.048

### Placement (x,y rotation side)
3.3V_REG  15.75,48.26 180 bottom
5V_REG  29.21,48.26 180 bottom
BSPD_CONN  41.53,74.68 180 bottom
C1  91.44,36.83 270 bottom
C2  91.44,29.21 270 bottom
C3  91.44,21.59 270 bottom
C4  91.44,13.97 270 bottom
C5  68.71,76.71 0 top
C6  68.71,75.31 0 top
C7  89.53,77.09 90 top
C8  79.88,77.09 90 top
C9  24.64,48.26 270 bottom
C10  6.86,48.26 270 bottom
C11  26.67,46.23 90 bottom
C12  26.67,50.29 90 bottom
C13  68.71,76.71 180 bottom
C14  68.71,75.31 180 bottom
D1  39.62,56.64 270 bottom
D2  71.12,38.1 270 bottom
D3  7.91,62.45 0 bottom
D4  44.07,63.5 0 bottom
D5  20.57,12.19 180 bottom
D6  28.57,12.19 180 bottom
DASHBOARD_CONN  99.44,40.64 270 bottom
F  27.3,65.02 90 bottom
F1  17.27,65.02 90 bottom
F2  12.19,65.02 90 bottom
F3  49.02,65.15 270 top
F4  53.98,65.15 270 top
F5  59.05,65.15 270 top
F6  63.37,65.28 0 bottom
F7  22.73,10.41 0 bottom
F8  26.42,10.41 180 bottom
F9  56.9,4.45 90 top
F10  90.42,38.99 180 top
F11  92.71,54.61 90 bottom
F12  92.71,50.8 90 bottom
F13  92.71,46.99 90 bottom
F14  92.71,43.18 90 bottom
F15  90.17,61.59 270 bottom
F16  70.48,4.45 270 top
F17  62.87,30.73 270 bottom
F18  62.61,40.01 0 top
HV_BOX_CONN  21.34,2.16 0 bottom
PEDAL_CONN  48.9,2.16 0 bottom
Q1  19.68,63.5 0 bottom
Q2  14.66,63.5 0 bottom
Q3  90.17,47.62 90 bottom
Q4  90.17,43.81 90 bottom
Q5  90.17,51.44 90 bottom
Q6  90.17,55.24 90 bottom
Q7  65.91,28.96 0 bottom
Q8  63.37,43.56 180 top
Q9  63.88,61.47 0 bottom
Q10  59.94,64.39 0 bottom
Q11  17.4,58.04 0 bottom
Q13  33.4,59.56 270 bottom
Q14  95,73.91 90 top
Q15  95,64.01 90 top
Q16  95,67.31 90 top
Q17  95,70.61 90 top
R1  36.7,60.58 0 bottom
R2  20.7,60.07 90 bottom
R3  15.62,60.33 90 bottom
R4  64.9,58.67 90 bottom
R5  87.63,51.18 270 bottom
R6  82.04,46.99 0 bottom
R7  82.04,43.18 0 bottom
R8  19.05,15.24 180 bottom
R9  27.05,15.24 0 bottom
R10  82.04,54.61 0 bottom
R11  66.93,25.65 90 bottom
R12  64.39,46.86 270 top
R13  64.26,19.68 90 top
R14  73.66,36.45 270 bottom
R15  66.93,46.1 90 top
R16  60.96,26.54 270 bottom
R17  36.7,58.55 0 bottom
R18  82.04,50.8 180 bottom
R19  87.63,47.37 270 bottom
R20  87.63,43.56 270 bottom
R21  87.63,54.99 270 bottom
R22  63.25,63.88 0 bottom
R23  30.61,60.2 90 bottom
R24  24.26,60.07 270 bottom
R25  19.18,60.07 270 bottom
R26  97.66,71.63 90 top
R27  92.84,72.52 0 top
R28  97.66,63.63 270 top
R29  92.84,62.61 0 top
R30  97.66,66.29 90 top
R31  92.84,65.91 0 top
R32  97.66,68.96 90 top
R33  92.84,69.22 0 top
R34  44.32,61.09 180 bottom
R35  66.29,75.95 90 bottom
R36  85.09,41.78 0 bottom
SBRIO_ANALOG  62.36,18.54 0 bottom
SBRIO_AUX  62.36,34.8 0 bottom
SHOCK_POT_CONN  76.45,2.16 0 bottom
SHTDWN_CONN  12.19,74.68 180 bottom
THERM_CONN  99.44,13.08 270 bottom
THERMO_1  85.09,38.1 270 bottom
THERMO_2  85.09,30.48 270 bottom
THERMO_3  85.09,22.86 270 bottom
THERMO_4  85.09,15.24 270 bottom
U1  29.72,63.5 0 bottom
U2  84.71,75.18 0 top
U3  71.75,71.5 90 top
U$2  3.56,18.54 270 bottom
U$3  73.28,40.03 270 top
U$15  65.91,48.9 90 top
U$16  64.14,25.02 90 bottom
U$17  85.09,51.82 90 bottom
U$18  85.09,48.01 90 bottom
U$19  85.09,44.2 90 bottom
U$20  85.09,55.63 90 bottom
U$23  22.48,58.04 0 bottom
WHEEL_SPEED  99.44,68.2 270 bottom

### Tracks (layer width: path | path; a pad name or v marks a point on that pad's centre or on a via)
3.3V  (via drill 0.38)
  Top 0.152: 67.82,75.82 67.82,76.71 C5.1 67.94,76.71 68.83,77.6 78.99,77.6 78.99,77.22 79.88,76.33 C8.1 79.88,76.2 82.68,76.2 U2.6 82.8,76.33 82.93,76.45 82.93,76.96 84.07,78.11 86.61,78.11 86.61,76.33 U2.1 86.74,76.2 89.53,76.2 C7.1 89.53,76.83 92.58,76.83 95.25,74.17 | 67.82,75.82 67.82,75.31 C6.1 67.94,75.31 68.33,74.93 68.33,72.14 69.85,70.61 U3.16 | U3.16 69.98,70.61 69.98,71.12 U3.15 | U3.1 70.74,69.72 69.98,70.48 U3.16 | 95.25,65.66 95.89,65.02 Q15.P$3 | 95.25,67.56 95.25,65.66 | 95.25,67.56 95.89,68.2 Q16.P$3 | 95.25,70.87 95.89,71.5 Q17.P$3 | 95.25,67.56 95.25,70.87 | 95.25,74.17 95.89,74.8 Q14.P$3 | 95.25,70.87 95.25,74.17 | v30.99,53.09 37.59,59.69 37.59,61.09 45.34,68.83 45.34,75.06 46.1,75.82 67.82,75.82 | v90.42,36.83 90.42,58.04 95.25,62.87 95.25,65.66
  Bottom 0.152: 90.42,36.2 THERMO_1.4 87.63,36.2 87.63,33.02 86.49,33.02 86.23,32.77 86.23,28.57 87.63,28.57 | 90.42,36.2 91.31,36.2 91.44,36.07 C1.2 | C2.2 91.44,28.45 91.31,28.57 THERMO_2.4 87.63,28.57 | C4.2 91.44,13.21 91.31,13.34 THERMO_4.4 87.63,13.34 87,13.97 86.49,13.97 86.23,14.22 86.23,20.95 | C3.2 91.44,20.83 91.31,20.95 THERMO_3.4 86.23,20.95 | 87.63,28.57 87.63,25.4 86.49,25.4 86.23,25.15 86.23,20.95 | 23.88,49.91 20.83,52.96 3.3V_REG.5 | 23.88,49.91 24.64,49.15 C9.1 | 23.88,49.91 27.05,53.09 v30.99,53.09 | v90.42,36.83 90.42,36.2
5V  (via drill 0.38)
  Top 0.152: v58.67,5.08 57.4,5.08 | 57.4,5.08 56.9,5.08 F9.2 | v69.47,5.08 70.48,5.08 F16.1 | v73.28,8.38 87,22.1 87,36.32 89.66,38.99 F10.2 | v58.04,22.23 57.78,21.97 57.78,21.34 57.4,20.95 57.4,5.08
  Bottom 0.152: C12.2 26.67,51.05 26.92,50.8 5V_REG.P$3 41.4,38.61 41.4,30.73 49.53,30.73 v58.04,22.23 | v58.67,5.08 v69.47,5.08 69.98,5.08 v73.28,8.38
12V  (via drill 0.38)
  Top 0.152: v64.14,28.83 64.14,43.31 63.63,43.31 62.48,44.45 Q8.P$3 62.48,44.58 62.48,46.86 | 62.48,46.86 v65.28,46.86 | SHTDWN_CONN.5 22.23,74.68 24.64,72.26 24.64,69.72 SHTDWN_CONN.6 | 62.48,46.86 62.1,47.24 62.1,60.33 v59.82,62.61
  Bottom 0.152: 90.42,48.51 90.42,45.97 89.28,44.83 Q4.P$3 | 90.42,48.51 89.28,48.51 Q3.P$3 89.15,48.64 88.14,49.66 74.93,49.66 73.91,48.64 67.06,48.64 v65.28,46.86 | 90.42,48.51 90.42,51.18 89.28,52.32 Q5.P$3 89.28,52.45 90.42,52.45 90.42,54.99 89.28,56.13 Q6.P$3 89.28,56.26 90.17,56.26 F15.2 | v64.14,28.83 64.9,28.07 Q7.P$3 | 26.67,45.47 26.92,45.72 5V_REG.P$1 | 10.67,52.96 6.86,49.15 C10.1 | 10.67,52.96 3.3V_REG.1 10.67,63.37 | 26.67,45.47 25.65,46.48 17.14,46.48 10.67,52.96 | 26.67,45.47 C11.1 | 12.95,63.25 12.83,63.37 10.67,63.37 | 12.95,63.25 13.59,62.61 Q2.P$3 | 10.67,63.37 8,63.37 D3.P$1 | 18.03,63.25 18.67,62.61 Q1.P$3 | 12.95,63.25 18.03,63.25 | 28.07,63.25 28.7,62.61 U1.P$3 | 18.03,63.25 24.64,63.25 | 24.64,63.25 28.07,63.25 | 28.07,63.25 58.8,63.25 58.93,63.37 Q10.P$3 59.05,63.37 v59.82,62.61 | 24.64,63.25 24.64,69.6 SHTDWN_CONN.6
AI1
  Top 0.152: SBRIO_ANALOG.P$6 58.42,20.45 59.31,19.56 59.31,3.05 57.28,1.02 29.34,1.02 HV_BOX_CONN.P$5
AI2  (via drill 0.38)
  Top 0.152: F5.2 59.05,64.39 57.66,62.99 57.66,37.47 57.4,37.21 57.4,21.59 56.39,20.57 SBRIO_ANALOG.P$8 56.26,20.45 55.37,19.56 55.37,8 v54.99,7.62
  Bottom 0.152: v54.99,7.62 32.89,7.62 27.43,2.16 HV_BOX_CONN.P$6
AI3
  Top 0.152: 53.34,21.46 53.34,37.21 53.59,37.47 53.59,64.01 53.98,64.39 F4.2 | 53.34,21.46 52.45,20.57 SBRIO_ANALOG.P$12 | 53.34,21.46 53.34,2.54 52.96,2.16 PEDAL_CONN.P$7
AI4
  Top 0.152: F3.2 49.02,64.39 49.4,64.01 49.4,21.46 50.29,20.57 SBRIO_ANALOG.P$14 50.42,20.45 51.31,19.56 51.31,2.54 50.93,2.16 PEDAL_CONN.P$8
AI7
  Top 0.152: SBRIO_ANALOG.P$24 40.39,20.45 41.4,19.43 41.4,3.56 42.8,2.16 PEDAL_CONN.P$4
AI8
  Top 0.152: SBRIO_ANALOG.P$3 60.45,18.54 60.83,18.16 60.83,10.29 70.1,1.02 78.36,1.02 78.36,2.16 SHOCK_POT_CONN.P$8
AI9  (via drill 0.38)
  Top 0.152: v64.01,16.64 72.77,7.87 72.77,5.84 SHOCK_POT_CONN.P$1
  Bottom 0.152: v64.01,16.64 60.33,16.64 58.42,18.54 SBRIO_ANALOG.P$5
AI10  (via drill 0.38)
  Top 0.152: v54.36,6.99 SBRIO_ANALOG.P$9
  Bottom 0.152: v54.36,6.99 58.04,3.3 73.28,3.3 74.42,2.16 SHOCK_POT_CONN.P$2
AI11  (via drill 0.38)
  Top 0.152: v32.26,30.99 32.26,33.02 30.48,34.8 SBRIO_AUX.P$33 | v61.47,15.88 71.25,6.1 71.25,3.3 72.39,2.16 SHOCK_POT_CONN.P$3
  Bottom 0.152: v32.26,30.99 41.27,21.97 48.26,21.97 49.4,20.83 49.4,17.53 51.31,17.53 52.32,18.54 SBRIO_ANALOG.P$11 52.45,18.54 54.74,16.26 61.09,16.26 v61.47,15.88
AI12  (via drill 0.38)
  Top 0.152: v35.43,32.89 47.37,20.95 47.37,19.43 48.26,18.54 SBRIO_ANALOG.P$15
  Bottom 0.152: v35.43,32.89 30.35,32.89 28.45,34.8 SBRIO_AUX.P$35
AI13  (via drill 0.38)
  Top 0.152: v34.04,32.26 45.34,20.95 45.34,19.56 SBRIO_ANALOG.P$17
  Bottom 0.152: v34.04,32.26 28.96,32.26 26.42,34.8 SBRIO_AUX.P$37
AI15
  Bottom 0.152: SBRIO_ANALOG.P$23 39.88,18.54 38.86,19.56 37.34,19.56 37.34,20.95 35.18,23.11 34.16,23.11 22.48,34.8 SBRIO_AUX.P$41
AMS_OK
  Bottom 0.152: F8.2 27.18,10.41 27.94,11.18 28.57,11.18 D6.P$1
AMS_OUT
  Bottom 0.152: Q5.P$1 92.71,51.44 F12.2
AO0
  Bottom 0.152: SBRIO_AUX.P$43 20.45,34.8 32.51,22.73 34.16,22.73 36.32,20.57 SBRIO_ANALOG.P$28
AO1
  Bottom 0.152: SBRIO_AUX.P$45 18.41,34.8 30.86,22.35 32.51,22.35 34.29,20.57 SBRIO_ANALOG.P$30
AO2
  Bottom 0.152: SBRIO_AUX.P$47 16.38,34.8 29.21,21.97 30.86,21.97 32.26,20.57 SBRIO_ANALOG.P$32
AO3
  Bottom 0.152: SBRIO_AUX.P$49 14.48,34.8 27.69,21.59 29.34,21.59 30.35,20.57 SBRIO_ANALOG.P$34
BSPD_OUT
  Bottom 0.152: Q4.P$1 92.71,43.81 F14.2
BUZZER_OUT
  Bottom 0.152: Q6.P$1 92.71,55.24 F11.2
CAN_GND
  Top 0.152: HV_BOX_CONN.P$1 6.48,17.02 6.48,19.43 U$2.P$3 U$2.P$6
CAN_H
  Top 0.152: U$2.P$7 6.1,14.73 6.1,13.34 17.27,2.16 HV_BOX_CONN.P$3 17.4,2.16 17.4,0.64 94.49,0.64 100.58,6.73 100.58,37.47 99.44,38.61 DASHBOARD_CONN.P$2
CAN_L
  Bottom 0.152: U$2.P$2 3.56,22.35 6.1,22.35 6.1,11.3 15.24,2.16 HV_BOX_CONN.P$4 15.37,2.16 16.51,1.02 100.58,1.02 100.58,35.43 99.44,36.58 DASHBOARD_CONN.P$3
DIO0  (via drill 0.38)
  Top 0.152: v69.22,67.94 69.22,63.25 70.1,62.36 U$3.228 | v92.84,70.61 93.22,70.99 93.22,72.26 93.47,72.52 R27.2 93.6,72.52 93.6,73.53 93.98,73.91 Q14.P$1
  Bottom 0.152: v69.22,67.94 71.88,70.61 v92.84,70.61
DIO1  (via drill 0.38)
  Top 0.152: v69.34,61.85 69.34,60.58 70.1,59.82 U$3.216 | v92.84,67.31 93.22,67.69 93.22,68.96 93.47,69.22 R33.2 93.6,69.22 93.6,70.23 93.98,70.61 Q17.P$1
  Bottom 0.152: v69.34,61.85 69.34,66.17 71.37,66.17 72.52,67.31 v92.84,67.31
DIO2  (via drill 0.38)
  Top 0.152: v70.74,59.05 70.74,58.55 70.1,58.55 U$3.210 | v92.84,65.02 93.47,65.66 93.47,65.91 R31.2 93.6,65.91 93.6,66.93 93.98,67.31 Q16.P$1
  Bottom 0.152: v70.74,59.05 70.99,59.31 85.98,59.31 91.69,65.02 v92.84,65.02
DIO3  (via drill 0.38)
  Top 0.152: v69.22,57.02 69.22,56.9 70.1,56.01 U$3.198 | v89.28,58.42 93.47,62.61 R29.2 93.6,62.61 93.6,63.63 93.98,64.01 Q15.P$1
  Bottom 0.152: v69.22,57.02 70.61,58.42 v89.28,58.42
DIO6  (via drill 0.38)
  Top 0.152: v70.74,51.44 70.74,50.93 70.1,50.93 U$3.174
  Bottom 0.152: v70.74,51.44 71.37,50.8 R18.1
DIO7  (via drill 0.38)
  Top 0.152: v70.74,47.62 70.1,48.26 U$3.162
  Bottom 0.152: v70.74,47.62 71.37,48.26 80.01,48.26 81.28,46.99 R6.2
DIO8  (via drill 0.38)
  Top 0.152: v70.74,45.09 70.74,46.35 70.1,46.99 U$3.156
  Bottom 0.152: v70.74,45.09 71.37,44.45 80.01,44.45 81.28,43.18 R7.2
DIO9  (via drill 0.38)
  Top 0.152: v70.74,43.81 70.1,44.45 U$3.144
  Bottom 0.152: v70.74,43.81 72.26,42.29 73.91,42.29 74.42,41.78 R36.2
DIO10  (via drill 0.38)
  Top 0.152: v61.34,61.98 67.69,55.63 67.69,45.72 70.1,43.31 U$3.138
  Bottom 0.152: 45.97,61.98 45.59,61.98 45.09,62.48 D4.P$2 | 45.97,61.98 v61.34,61.98 | 45.97,61.98 45.09,61.09 R34.2
DIO11  (via drill 0.38)
  Top 0.152: v67.18,40.77 70.1,40.77 U$3.126 | v40.51,53.09 38.23,55.37 v38.23,59.94
  Bottom 0.152: v67.18,40.77 67.06,40.89 52.7,40.89 v40.51,53.09 | v38.23,59.94 37.59,60.58 R1.1
DIO12  (via drill 0.38)
  Top 0.152: v70.74,40.01 70.74,39.5 70.1,39.5 U$3.120
  Bottom 0.152: v70.74,40.01 71.63,39.12 71.75,39.12 | 71.75,39.12 72.01,39.12 D2.P$2 71.75,39.12 | 71.75,39.12 73.66,37.21 R14.1
DIO13  (via drill 0.38)
  Top 0.152: v66.55,43.69 66.55,40.51 70.1,36.96 U$3.108 | v63.88,57.66 v63.88,49.15
  Bottom 0.152: v66.55,43.69 63.88,46.35 v63.88,49.15 | v63.88,57.66 64.14,57.91 64.9,57.91 R4.1
DIO14  (via drill 0.38)
  Top 0.152: v69.22,35.56 70.1,35.56 | v78.61,51.94 78.36,51.69 78.36,44.83 77.09,43.56 77.09,37.85 76.71,37.47 72.14,37.47 72.14,37.21 72.01,37.08 72.01,35.31 71.63,34.92 70.1,34.92 70.1,35.56 | 70.1,35.56 U$3.102
  Bottom 0.152: v69.22,35.56 67.44,33.78 61.47,33.78 60.45,34.8 SBRIO_AUX.P$3 | v78.61,51.94 81.28,54.61 R10.2
DIO15  (via drill 0.38)
  Top 0.152: v69.22,33.15 70.1,33.15 U$3.90
  Bottom 0.152: v69.22,33.15 68.96,33.4 59.82,33.4 58.42,34.8 SBRIO_AUX.P$5
DIO16  (via drill 0.38)
  Top 0.152: v72.01,62.87 73.28,62.87 73.91,63.5 U$3.231 | v48.77,57.78 48.39,57.4 48.39,36.83 SBRIO_AUX.P$16 48.26,36.7 47.37,35.81 47.37,34.42 v48.26,33.53
  Bottom 0.152: v72.01,62.87 70.36,61.21 52.2,61.21 v48.77,57.78 | v48.26,33.53 54.74,33.53 60.96,27.3 R16.1
DIO17  (via drill 0.38)
  Top 0.152: v73.28,61.59 73.91,62.23 U$3.225 | v52.96,58.67 50.42,56.13 50.42,36.83 SBRIO_AUX.P$14
  Bottom 0.152: v73.28,61.59 71.37,59.69 66.55,59.69 65.53,58.67 v52.96,58.67
DIO18  (via drill 0.38)
  Top 0.152: v75.82,52.7 75.82,59.05 74.55,59.05 73.91,59.69 U$3.213 | v52.96,41.53 52.45,41.02 52.45,36.83 SBRIO_AUX.P$12
  Bottom 0.152: v75.82,52.7 75.18,52.07 69.85,52.07 67.94,50.16 61.59,50.16 v52.96,41.53
DIO19  (via drill 0.38)
  Top 0.152: v74.55,56.52 74.55,57.78 73.91,58.42 U$3.207 | v57.02,55.37 54.48,52.83 54.48,36.83 SBRIO_AUX.P$10
  Bottom 0.152: v74.55,56.52 73.41,55.37 v57.02,55.37
DIO20  (via drill 0.38)
  Top 0.152: v73.28,56.52 73.28,56.01 73.91,56.01 U$3.195
  Bottom 0.152: v73.28,56.52 73.15,56.39 42.42,56.39 41.27,57.53 40.64,57.53 D1.P$2 40.51,57.66 38.35,57.66 37.47,58.55 R17.1
DIO29
  Top 0.152: U$3.117 73.91,39.5 74.55,40.13 74.55,40.89 74.93,41.27 75.82,41.27 75.82,51.05 76.2,51.44 77.98,51.44 77.98,70.61 82.55,75.18 U2.7
DIO30  (via drill 0.38)
  Top 0.152: U$3.105 73.91,36.83 74.55,36.2 75.82,36.2 75.82,23.88 76.2,23.5 85.85,23.5 v85.85,67.94 85.85,74.04 U2.12 | v72.9,67.94 72.9,69.47 72.77,69.6 U3.4
  Bottom 0.152: v85.85,67.94 v72.9,67.94
DIO31  (via drill 0.38)
  Top 0.152: U$3.99 73.91,35.56 74.55,34.92 74.55,22.61 74.93,22.23 86.61,22.23 v86.61,68.58 86.61,74.04 U2.13 | v72.14,68.58 72.14,69.6 U3.3
  Bottom 0.152: v86.61,68.58 v72.14,68.58
DIO32  (via drill 0.38)
  Top 0.152: U$3.221 71.37,61.09 70.74,61.72 70.74,66.29 71.37,66.93 71.37,69.6 U3.2 71.5,69.72 71.5,71.12 v72.52,72.14 | v87.5,74.3 87.5,74.55 86.87,75.18 U2.14
  Bottom 0.152: v87.5,74.3 85.34,72.14 v72.52,72.14
DIO33  (via drill 0.38)
  Top 0.152: v72.01,61.59 72.01,60.45 71.37,59.82 U$3.215 | v72.77,66.67 73.53,67.44 73.53,70.48 U3.5
  Bottom 0.152: v72.01,61.59 72.77,62.36 v72.77,66.67
DIO34  (via drill 0.38)
  Top 0.152: v68.58,69.98 68.58,55.24 70.36,55.24 70.74,55.63 70.74,56.52 71.37,57.15 U$3.203 | v72.52,71.25 73.03,71.75 73.53,71.75 U3.7
  Bottom 0.152: v68.58,69.98 69.85,71.25 v72.52,71.25
DIO35
  Top 0.152: U$3.197 71.37,56.01 72.01,56.64 72.01,59.94 72.39,60.33 74.55,60.33 74.55,63.75 74.17,64.14 73.28,64.14 73.28,66.29 74.42,67.44 74.42,70.87 74.17,71.12 73.66,71.12 U3.6
DIO36  (via drill 0.38)
  Top 0.152: v74.55,55.24 72.39,55.24 72.01,54.86 72.01,54.1 71.37,53.47 U$3.185 | v78.61,57.78 82.68,61.85 82.68,74.04 U2.8
  Bottom 0.152: v74.55,55.24 77.09,57.78 v78.61,57.78
DIO37  (via drill 0.38)
  Top 0.152: v72.01,52.7 72.01,52.2 71.37,52.2 U$3.179 | v79.5,57.78 83.44,61.72 83.44,74.04 U2.9
  Bottom 0.152: v72.01,52.7 72.64,53.34 75.06,53.34 v79.5,57.78
DIO38  (via drill 0.38)
  Top 0.152: v70.74,50.16 70.74,49.66 71.37,49.66 U$3.167
  Bottom 0.152: v70.74,50.16 70.36,49.78 63.63,49.78 63.25,49.4 63.25,41.4 68.2,41.4 68.58,41.02 68.58,37.85 57.4,37.85 56.39,36.83 SBRIO_AUX.P$8
DIO39
  Top 0.152: U$3.161 71.37,48.26 72.01,47.62 72.01,42.93 71.63,42.55 67.94,42.55 67.94,44.32 66.93,45.34 R15.1
GND  (via drill 0.38)
  Top 0.152: SBRIO_AUX.P$23 SBRIO_AUX.P$25 36.45,34.8 | 34.42,34.8 34.42,36.7 SBRIO_AUX.P$30 | 36.45,34.8 36.45,36.7 SBRIO_AUX.P$28 36.45,36.83 38.35,36.83 SBRIO_AUX.P$26 38.48,36.83 40.26,36.83 SBRIO_AUX.P$24 40.39,36.83 42.29,36.83 SBRIO_AUX.P$22 42.42,36.7 42.42,34.8 | 34.42,34.8 SBRIO_AUX.P$27 36.45,34.8 | 34.42,34.8 SBRIO_AUX.P$29 | SBRIO_AUX.P$7 SBRIO_AUX.P$9 | SBRIO_AUX.P$11 SBRIO_AUX.P$13 | 44.45,34.8 44.45,36.7 SBRIO_AUX.P$20 44.45,36.83 46.35,36.83 SBRIO_AUX.P$18 | 42.42,34.8 SBRIO_AUX.P$19 44.45,34.8 | 42.42,34.8 SBRIO_AUX.P$21 | 44.45,34.8 SBRIO_AUX.P$17 | SHTDWN_CONN.9 32.26,74.68 34.67,72.26 34.67,69.72 SHTDWN_CONN.10 34.67,69.6 30.35,65.28 30.35,49.4 5V_REG.P$2 28.07,47.12 28.07,36.83 | SBRIO_AUX.P$31 32.38,34.8 32.38,36.7 SBRIO_AUX.P$32 32.26,36.83 30.48,36.83 SBRIO_AUX.P$34 30.35,36.83 28.45,36.83 SBRIO_AUX.P$36 | 28.07,36.83 28.32,36.83 SBRIO_AUX.P$36 | 28.07,36.83 26.42,36.83 SBRIO_AUX.P$38 26.29,36.83 24.38,36.83 SBRIO_AUX.P$40 24.26,36.83 22.48,36.83 SBRIO_AUX.P$42 22.35,36.83 20.45,36.83 SBRIO_AUX.P$44 20.32,36.83 18.41,36.83 SBRIO_AUX.P$46 18.29,36.83 16.38,36.83 SBRIO_AUX.P$48 16.26,36.83 14.48,36.83 SBRIO_AUX.P$50 | 28.07,36.83 SBRIO_AUX.P$36 | 92.2,65.91 92.2,62.61 R29.1 92.08,62.61 v87.25,57.78 v87.25,49.02 | 92.2,72.52 92.2,69.22 | 92.2,69.22 92.2,65.91 | 92.2,65.91 R31.1 | 92.2,69.22 R33.1 | U$3.237 73.91,64.9 74.8,65.79 74.8,71.75 74.17,72.39 73.66,72.39 U3.8 73.53,72.52 72.77,73.28 U3.9 72.64,73.41 72.14,73.41 U3.10 72.01,73.41 71.5,73.41 U3.11 71.37,73.41 70.87,73.41 U3.12 | 69.6,75.31 69.6,76.71 C5.2 | U3.13 69.98,72.52 70.74,73.28 U3.12
  Top 0.152: 69.85,75.06 70.74,74.17 70.74,73.41 U3.12 | 69.85,75.06 69.6,75.31 | 69.6,75.31 C6.2 69.85,75.06 | 69.85,75.06 v68.96,74.17 | C8.2 79.88,77.98 83.44,77.98 83.95,78.49 89.53,78.49 C7.2 89.53,77.85 99.44,77.85 WHEEL_SPEED.P$5 | U2.5 83.57,76.33 84.2,76.33 U2.4 84.33,76.33 84.33,77.22 85.47,77.22 85.6,77.09 | 85.6,77.09 85.72,76.96 85.72,76.45 85.85,76.33 U2.2 | v85.98,77.47 85.6,77.09 | v92.2,76.2 92.2,72.52 | 92.2,72.52 R27.1 | SBRIO_ANALOG.P$49 SBRIO_ANALOG.P$47 SBRIO_ANALOG.P$45 SBRIO_ANALOG.P$43 SBRIO_ANALOG.P$41 SBRIO_ANALOG.P$39 | SBRIO_ANALOG.P$37 SBRIO_ANALOG.P$35 SBRIO_ANALOG.P$33 SBRIO_ANALOG.P$31 SBRIO_ANALOG.P$29 SBRIO_ANALOG.P$27 SBRIO_ANALOG.P$25 | SBRIO_ANALOG.P$16 48.39,20.45 50.29,18.54 SBRIO_ANALOG.P$13 | SBRIO_ANALOG.P$22 42.42,20.45 44.32,18.54 SBRIO_ANALOG.P$19 | SBRIO_ANALOG.P$25 38.35,20.45 SBRIO_ANALOG.P$26 | SBRIO_ANALOG.P$25 | THERM_CONN.P$4 THERM_CONN.P$3 THERM_CONN.P$2 THERM_CONN.P$1 v97.92,14.61 | U$15.P$3 66.8,49.78 65.91,48.9 65.91,42.93 65.02,42.04 65.02,19.81 R13.1 64.26,18.92 62.36,18.92 SBRIO_ANALOG.P$1 SBRIO_ANALOG.P$4
  Bottom 0.152: 19.94,57.78 20.83,57.78 21.46,57.15 U$23.P$3 21.59,57.15 22.48,58.04 33.78,58.04 34.29,58.55 Q13.P$3 34.42,58.55 R17.2 36.07,58.55 36.83,59.31 45.47,59.31 | 19.94,57.78 17.14,57.78 16.51,57.15 Q11.P$3 | 45.47,59.31 43.69,61.09 R34.1 | 45.47,59.31 47.62,57.15 49.02,57.15 51.18,59.31 61.72,59.31 62.87,60.45 Q9.P$3 | SBRIO_AUX.P$17 SBRIO_AUX.P$15 SBRIO_AUX.P$13 | SBRIO_AUX.P$11 SBRIO_AUX.P$9 | C10.2 6.86,47.37 10.41,43.81 11.56,43.81 3.3V_REG.9 3.3V_REG.7 18.29,36.83 SBRIO_AUX.P$46 | 26.67,47.12 24.89,47.12 24.64,47.37 C9.2 24.64,47.5 19.94,47.5 19.94,57.78 | 26.67,47.12 26.67,48.26 | 26.67,48.26 C12.1 | 26.67,47.12 C11.2 | 5V_REG.P$2 26.67,48.26 | SBRIO_AUX.P$31 SBRIO_AUX.P$29 | 85.34,56.52 85.34,53.98 84.2,52.83 U$17.P$3 | 85.34,56.52 84.2,56.52 U$20.P$3 | 85.34,56.52 86.61,57.78 v87.25,57.78 | R35.1 66.29,75.18 66.42,75.31 C14.1 67.94,75.31 67.94,74.17 v68.96,74.17 69.6,73.53 82.04,73.53 v85.98,77.47 87.25,76.2 v92.2,76.2 WHEEL_SPEED.P$5 | R8.1 18.41,15.24 18.41,18.54 SBRIO_ANALOG.P$45 | R9.2 26.42,15.24 26.42,18.54 SBRIO_ANALOG.P$37 SBRIO_ANALOG.P$39 | 56.39,18.54 55.37,19.56 | 55.37,19.56 54.48,20.45 SBRIO_ANALOG.P$10 | 55.37,19.56 51.44,19.56 50.42,18.54 SBRIO_ANALOG.P$13 | SBRIO_ANALOG.P$22 42.29,20.45 41.4,19.56 39.37,19.56 38.48,20.45 SBRIO_ANALOG.P$26 | SBRIO_ANALOG.P$16 48.26,20.45 47.37,19.56 45.47,19.56 44.45,18.54 SBRIO_ANALOG.P$19 | 90.42,15.88 91.44,14.86 C4.1 91.44,14.73 91.57,14.61 v97.92,14.61 | 87.76,15.88 90.42,15.88 | 87.76,15.88 87.76,17.14 THERMO_4.1 | 87.76,15.88 THERMO_4.2 | 87.76,23.5 90.42,23.5 91.44,22.48 C3.1 91.44,22.35 95.63,22.35 95.63,21.08 90.42,15.88
  Bottom 0.152: 87.76,23.5 87.76,24.77 THERMO_3.1 | 87.76,23.5 THERMO_3.2 | 80.9,2.54 85.34,6.99 99.44,6.99 THERM_CONN.P$4 | 80.9,2.54 80.52,2.16 SHOCK_POT_CONN.P$7 80.9,2.54 | 84.33,48.77 85.34,47.75 85.34,45.21 84.2,45.21 U$19.P$3 84.2,45.09 85.34,43.94 85.34,41.78 R36.1 85.85,41.78 87.63,40.01 THERMO_1.1 87.76,40.01 87.76,38.73 | 84.33,48.77 84.2,48.9 U$18.P$3 84.33,48.77 | 90.42,31.11 91.44,30.1 C2.1 | 87.76,31.11 90.42,31.11 | 87.76,31.11 87.76,32.38 THERMO_2.1 | 87.76,31.11 THERMO_2.2 | 73.79,35.56 73.66,35.69 R14.2 73.79,35.56 | 73.79,35.56 83.95,35.56 87.12,38.73 THERMO_1.2 87.76,38.73 | 87.76,38.73 90.42,38.73 91.44,37.72 C1.1 91.44,37.59 93.6,37.59 93.6,34.29 90.42,31.11 | 64.39,18.54 64.39,24.26 | 64.39,24.26 64.39,24.77 63.25,25.91 U$16.P$3 63.12,26.04 63.12,28.07 56.39,34.8 SBRIO_AUX.P$7 | SBRIO_ANALOG.P$1 64.39,18.54 | 73.79,35.56 67.69,29.46 67.69,24.26 64.39,24.26 | 80.9,2.54 64.9,18.54 64.39,18.54 | 56.39,18.54 57.4,19.56 59.44,19.56 60.33,20.45 SBRIO_ANALOG.P$4 | 56.39,18.54 SBRIO_ANALOG.P$7 | v87.25,49.02 87,48.77 84.33,48.77
IMD_OK
  Bottom 0.152: F7.2 21.97,10.41 21.21,11.18 20.57,11.18 D5.P$1
IMD_OUT
  Bottom 0.152: Q3.P$1 92.71,47.62 F13.2
N$1
  Bottom 0.152: D2.P$1 70.1,38.1 68.83,36.83 62.36,36.83 SBRIO_AUX.P$2
N$2  (via drill 0.38)
  Top 0.152: v58.29,54.74 61.72,51.31 61.72,41.53 62.61,40.64 62.61,38.99 60.45,36.83 SBRIO_AUX.P$4
  Bottom 0.152: v58.29,54.74 38.73,54.74 38.73,56.64 D1.P$1
N$3
  Top 0.152: WHEEL_SPEED.P$1 97.66,68.2 R32.1
N$4
  Top 0.152: R13.2 64.26,20.45 62.36,20.45 SBRIO_ANALOG.P$2
  Bottom 0.152: D3.P$2 8.76,61.34 5.59,58.17 5.59,48.26 14.86,48.26 19.3,43.81 24.77,43.81 31.37,37.21 31.37,33.53 38.1,33.53 50.04,21.59 61.34,21.59 62.36,20.57 SBRIO_ANALOG.P$2
N$5
  Bottom 0.152: Q6.P$2 89.15,54.36 87.63,54.36 R21.2
N$6
  Top 0.152: R30.2 97.66,66.42 96.01,66.42 Q16.P$2
N$7
  Bottom 0.152: F1.1 17.27,64.39 19.68,64.39 Q1.P$1
N$8
  Bottom 0.152: F2.1 12.19,64.39 14.61,64.39 Q2.P$1
N$9
  Top 0.152: R28.1 97.66,64.26 99.44,64.26 WHEEL_SPEED.P$3
N$10
  Top 0.152: WHEEL_SPEED.P$8 99.44,70.87 97.66,70.87 R26.1
N$11  (via drill 0.38)
  Top 0.152: v73.28,53.98 73.91,54.61 U$3.189 | v28.45,53.72 26.04,56.13 v26.04,58.93
  Bottom 0.152: v73.28,53.98 73.03,53.72 v28.45,53.72 | v26.04,58.93 24.26,60.71 R24.1
N$12  (via drill 0.38)
  Top 0.152: v74.55,53.98 74.55,52.83 73.91,52.2 U$3.177 | v24.38,56.52 19.94,60.96 v19.94,61.59
  Bottom 0.152: v74.55,53.98 73.91,54.61 59.05,54.61 58.55,54.1 28.96,54.1 26.54,56.52 v24.38,56.52 | v19.94,61.59 19.18,60.83 R25.1
N$13  (via drill 0.38)
  Top 0.152: v25.65,8.89 25.4,8.64 25.4,2.16 HV_BOX_CONN.P$7
  Bottom 0.152: v25.65,8.89 25.65,10.41 F8.1
N$14  (via drill 0.38)
  Top 0.152: v23.37,8.89 23.37,2.16 HV_BOX_CONN.P$8
  Bottom 0.152: v23.37,8.89 23.37,10.41 F7.1
N$15  (via drill 0.38)
  Top 0.152: v25.4,17.78 25.4,20.95 33.4,28.96 33.4,37.21 42.16,45.97 42.16,65.15 59.69,65.15 68.07,56.77 68.07,54.74 70.1,54.74 U$3.192
  Bottom 0.152: v25.4,17.78 22.86,15.24 R8.2 19.68,15.24 19.68,13.21 D5.P$2
N$16  (via drill 0.38)
  Top 0.152: v69.09,45.21 69.09,51.05 70.1,52.07 U$3.180 | v65.91,42.04 65.41,41.53 v65.41,17.14
  Bottom 0.152: v65.91,42.04 v69.09,45.21 | v65.41,17.14 63.5,15.24 R9.1 27.69,15.24 27.69,13.21 D6.P$2
N$17  (via drill 0.38)
  Top 0.152: v73.28,47.62 73.28,50.16 73.91,50.8 U$3.171 | v84.2,37.59 v84.2,30.99
  Bottom 0.152: 80.39,25.02 78.99,25.02 78.99,18.8 81.28,16.51 81.79,16.51 82.42,15.88 THERMO_4.7 | 80.39,25.02 81.92,23.5 THERMO_3.7 | 83.69,30.48 83.19,30.48 82.55,31.11 THERMO_2.7 | 83.69,30.48 83.95,30.23 83.95,29.21 81.28,29.21 80.39,28.32 80.39,25.02 | v73.28,47.62 71.37,45.72 70.48,45.72 70.1,45.34 70.1,41.91 73.79,41.91 76.96,38.73 THERMO_1.7 83.06,38.73 v84.2,37.59 | v84.2,30.99 83.69,30.48
N$18  (via drill 0.38)
  Top 0.152: v74.55,50.16 74.55,49.02 73.91,48.39 U$3.159 | v82.55,27.69 80.9,29.34 v80.9,36.83
  Bottom 0.152: 83.95,20.95 83.95,14.22 83.69,13.97 83.19,13.97 82.55,13.34 THERMO_4.5 | THERMO_3.5 83.95,20.95 | 83.95,20.95 83.95,25.15 83.69,25.4 82.55,25.4 v82.55,27.69 82.55,28.57 THERMO_2.5 | v74.55,50.16 73.41,49.02 66.55,49.02 64.64,47.12 64.64,46.23 67.31,46.23 69.09,48.01 69.6,48.01 69.98,47.62 69.98,45.72 69.72,45.47 69.72,40.64 73.41,40.64 77.85,36.2 80.9,36.2 | THERMO_1.5 80.9,36.2 | 80.9,36.2 v80.9,36.83
N$20
  Top 0.152: F16.2 70.48,2.16 SHOCK_POT_CONN.P$4
N$21
  Bottom 0.152: F15.1 99.44,62.23 WHEEL_SPEED.P$4
N$22
  Top 0.152: F9.1 PEDAL_CONN.P$5
N$23
  Top 0.152: F10.1 91.19,38.99 95.5,34.67 99.44,34.67 DASHBOARD_CONN.P$4
N$24
  Bottom 0.152: F11.1 92.71,53.85 97.92,48.64 DASHBOARD_CONN.P$5
N$25  (via drill 0.38)
  Top 0.152: v73.28,41.27 73.28,46.35 73.91,46.99 U$3.153
  Bottom 0.152: v73.28,41.27 77.09,37.47 THERMO_1.6
N$26  (via drill 0.38)
  Top 0.152: v74.55,43.81 73.91,44.45 U$3.141 | v77.72,43.31 77.47,43.05 v77.47,34.29
  Bottom 0.152: v74.55,43.81 75.06,43.31 v77.72,43.31 | v77.47,34.29 81.92,29.84 THERMO_2.6
N$27  (via drill 0.38)
  Top 0.152: v74.55,42.55 73.91,43.18 U$3.135 | v78.11,42.42 79.63,40.89 v79.63,24.38
  Bottom 0.152: v74.55,42.55 74.68,42.42 v78.11,42.42 | v79.63,24.38 81.79,22.23 THERMO_3.6
N$28  (via drill 0.38)
  Top 0.152: v68.58,27.94 68.58,36.2 70.36,36.2 70.74,36.58 70.74,37.47 71.63,37.47 72.01,37.85 72.01,40.01 73.28,40.01 73.91,40.64 U$3.123
  Bottom 0.152: v68.58,27.94 81.92,14.61 THERMO_4.6
N$29  (via drill 0.38)
  Top 0.152: v89.28,36.83 99.44,26.67 THERM_CONN.P$5
  Bottom 0.152: v89.28,36.83 88.39,36.83 87.76,37.47 THERMO_1.3
N$30
  Bottom 0.152: THERMO_2.3 87.76,29.84 88.39,29.21 92.08,29.21 98.3,22.99 98.3,19.18 99.44,19.18 THERM_CONN.P$6
N$31  (via drill 0.38)
  Top 0.152: v95,21.59 99.44,17.14 THERM_CONN.P$7
  Bottom 0.152: v95,21.59 88.39,21.59 87.76,22.23 THERMO_3.3
N$32
  Bottom 0.152: THERMO_4.3 87.76,14.61 88.39,13.97 98.42,13.97 99.44,14.99 THERM_CONN.P$8
N$33
  Bottom 0.152: F12.1 92.71,50.04 96.01,46.74 99.44,46.74 DASHBOARD_CONN.P$6
N$34
  Bottom 0.152: F13.1 92.71,46.23 94.23,44.7 99.44,44.7 DASHBOARD_CONN.P$7
N$35
  Bottom 0.152: F14.1 92.71,42.55 99.44,42.55 DASHBOARD_CONN.P$8
N$36
  Bottom 0.152: 27.3,69.6 F.2 | 27.3,69.6 29.59,69.6 SHTDWN_CONN.8 | 27.3,69.6 27.3,74.68 SHTDWN_CONN.7
N$37  (via drill 0.38)
  Top 0.152: v69.85,74.17 69.09,73.41 69.09,71.88 69.85,71.88 U3.14
  Bottom 0.152: v69.85,74.17 69.85,75.31 69.6,75.31 | 69.6,75.31 69.6,76.71 C13.2 | 69.6,75.31 C14.2
N$38
  Bottom 0.152: C13.1 66.29,76.71 R35.2
N$39
  Bottom 0.152: 17.27,69.6 F1.2 | 17.27,69.6 19.68,69.6 SHTDWN_CONN.4 | 17.27,69.6 17.27,74.68 SHTDWN_CONN.3
N$40
  Bottom 0.152: 12.19,69.6 F2.2 | 12.19,69.6 14.61,69.6 SHTDWN_CONN.2 | 12.19,69.6 SHTDWN_CONN.1
N$41
  Top 0.152: BSPD_CONN.9 61.59,74.68 64.01,72.26 64.01,69.72 BSPD_CONN.10
  Bottom 0.152: F6.1 64.01,65.28 64.01,69.6 BSPD_CONN.10
N$42
  Top 0.152: BSPD_CONN.1 43.94,72.26 43.94,69.72 BSPD_CONN.2
  Bottom 0.152: D4.P$1 44.07,69.6 BSPD_CONN.2
N$43
  Top 0.152: F5.1 59.05,69.6 BSPD_CONN.8 58.93,69.72 58.93,72.39 56.64,74.68 BSPD_CONN.7
N$44
  Bottom 0.152: F.1 27.3,64.39 29.72,64.39 U1.P$1
N$45
  Bottom 0.152: F6.2 59.94,65.28 Q10.P$1
N$46
  Bottom 0.152: R23.2 30.61,62.48 U1.P$2
N$47
  Bottom 0.152: R2.2 20.7,62.48 Q1.P$2
N$48
  Bottom 0.152: R3.2 15.62,62.48 Q2.P$2
N$49
  Bottom 0.152: R22.2 61.34,63.88 60.96,63.5 Q10.P$2
N$50
  Bottom 0.152: Q5.P$2 89.15,50.55 87.63,50.55 R5.2
N$51
  Bottom 0.152: Q3.P$2 89.15,46.74 87.63,46.74 R19.2
N$52
  Top 0.152: F4.1 53.98,69.6 BSPD_CONN.6 53.98,69.72 53.98,72.26 51.56,74.68 BSPD_CONN.5
N$53
  Top 0.152: F3.1 49.02,69.6 BSPD_CONN.4 49.02,69.72 49.02,72.26 46.61,74.68 BSPD_CONN.3
N$54
  Bottom 0.152: R11.2 66.93,27.94 Q7.P$2
N$55
  Bottom 0.152: SBRIO_AUX.P$1 61.34,35.81 57.4,35.81 57.4,34.42 59.05,32.77 61.59,32.77 62.87,31.5 F17.1
N$56
  Bottom 0.152: F17.2 62.87,29.97 65.91,29.97 Q7.P$1
N$57
  Top 0.152: Q8.P$1 63.37,40.01 F18.2
N$58
  Top 0.152: R12.2 64.39,44.58 Q8.P$2
N$59
  Top 0.152: F18.1 61.85,40.01 58.67,36.83 58.42,36.83 SBRIO_AUX.P$6
N$60
  Top 0.152: R15.2 66.93,47.88 U$15.P$2
N$61
  Top 0.152: R12.1 64.39,47.62 64.9,48.13 64.9,48.9 U$15.P$1
N$62
  Bottom 0.152: U$16.P$2 63.12,24.13 61.47,25.78 60.96,25.78 R16.2
N$63
  Bottom 0.152: U$16.P$1 66.93,25.02 R11.1
N$64
  Bottom 0.152: U$17.P$1 87.63,51.82 R5.1
N$65
  Bottom 0.152: R18.2 84.07,50.8 U$17.P$2
N$66
  Bottom 0.152: U$18.P$1 87.63,48.01 R19.1
N$67
  Bottom 0.152: R6.1 84.07,46.99 U$18.P$2
N$68
  Bottom 0.152: Q4.P$2 89.15,42.93 87.63,42.93 R20.2
N$69
  Bottom 0.152: U$19.P$1 87.63,44.2 R20.1
N$70
  Bottom 0.152: R7.1 84.07,43.18 U$19.P$2
N$71
  Bottom 0.152: U$20.P$1 87.63,55.63 R21.1
N$72
  Bottom 0.152: R10.1 84.07,54.61 U$20.P$2
N$73
  Bottom 0.152: Q9.P$1 63.88,63.88 R22.1
N$74
  Bottom 0.152: R4.2 64.9,60.45 Q9.P$2
N$75
  Bottom 0.152: Q13.P$1 30.61,59.56 R23.1
N$76
  Bottom 0.152: R1.2 34.42,60.58 Q13.P$2
N$77
  Bottom 0.152: U$23.P$1 22.48,59.05 22.23,59.31 20.7,59.31 R2.1
N$78
  Bottom 0.152: Q11.P$1 17.4,59.05 16.89,59.56 15.62,59.56 R3.1
N$79  (via drill 0.38)
  Top 0.152: v24.38,57.4 25.15,58.17 v25.15,58.67
  Bottom 0.152: v24.38,57.4 23.75,57.4 23.5,57.15 U$23.P$2 | v25.15,58.67 24.51,59.31 24.26,59.31 R24.2
N$80
  Bottom 0.152: Q11.P$2 18.29,57.02 17.53,56.26 15.88,56.26 15.75,56.39 15.75,58.29 18.16,58.29 19.18,59.31 R25.2
N$81
  Top 0.152: R26.2 97.66,72.9 96.01,72.9 Q14.P$2
N$82
  Top 0.152: Q15.P$2 96.01,62.99 97.66,62.99 R28.2
N$83
  Top 0.152: WHEEL_SPEED.P$2 99.44,65.66 97.66,65.66 R30.1
N$84
  Top 0.152: Q17.P$2 96.01,69.72 97.66,69.72 R32.2
SHIELD
  Top 0.152: 5.21,18.16 6.1,17.27 6.1,15.37 19.3,2.16 HV_BOX_CONN.P$2 | U$2.P$10 3.56,14.73 3.56,16.51 5.21,18.16 | 5.21,18.16 U$2.P$5
STEERING_POS
  Top 0.152: PEDAL_CONN.P$3 44.83,2.16 42.42,4.57 42.42,18.54 SBRIO_ANALOG.P$21
  Bottom 0.152: SBRIO_ANALOG.P$21 43.31,18.54 43.31,20.95 42.67,21.59 37.59,21.59 24.38,34.8 SBRIO_AUX.P$39
THROTTLE_1
  Top 0.152: PEDAL_CONN.P$1 47.37,3.68 47.37,18.92 46.99,19.3 46.99,19.94 46.48,20.45 SBRIO_ANALOG.P$18
THROTTLE_2
  Top 0.152: SBRIO_ANALOG.P$20 44.45,20.45 44.96,19.94 44.96,19.3 45.34,18.92 45.34,3.68 46.86,2.16 PEDAL_CONN.P$2

### Text on the board
bPlace: Layout By: Kendall Searing | Formula Electric 2014: sbRIO Daughter Card v4 | Design By: Thomas Willson